# EAGLE schematic Proto (EAGLE 9.4.0)
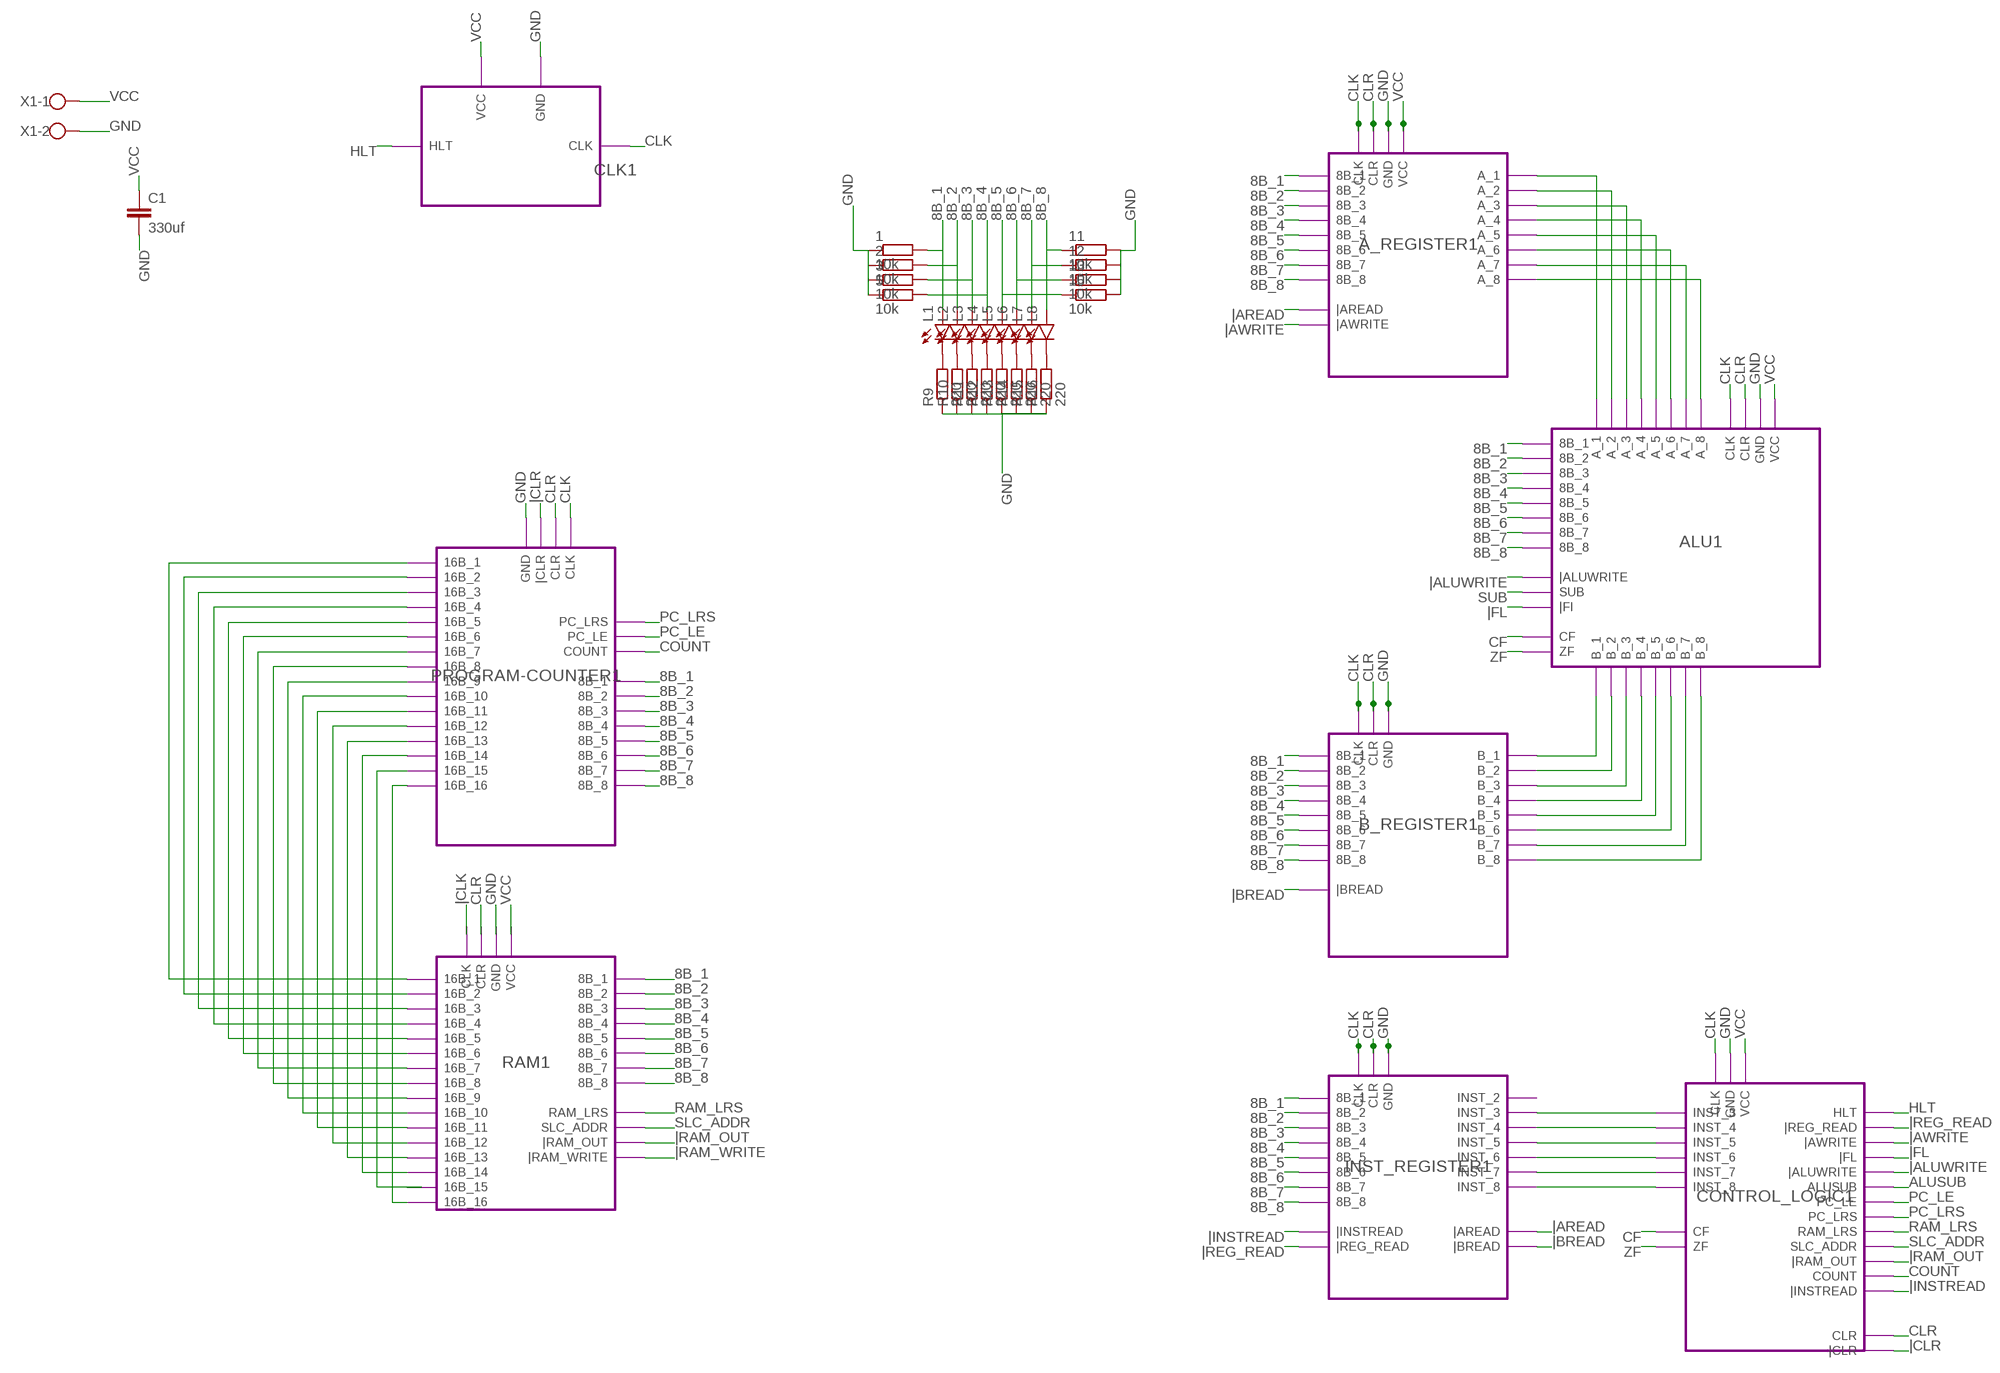
[diagram p0: schematic, sheet 1]

## Parts
1  10k  R-EU_0204/7  [0204/7]
2  10k  R-EU_0204/7  [0204/7]
3  10k  R-EU_0204/7  [0204/7]
5  10k  R-EU_0204/7  [0204/7]
11  10k  R-EU_0204/7  [0204/7]
12  10k  R-EU_0204/7  [0204/7]
13  10k  R-EU_0204/7  [0204/7]
15  10k  R-EU_0204/7  [0204/7]
C1  330uf  C-EU025-025X050  [C025-025X050]
L1  LED5MM  [LED5MM]
L2  LED5MM  [LED5MM]
L3  LED5MM  [LED5MM]
L4  LED5MM  [LED5MM]
L5  LED5MM  [LED5MM]
L6  LED5MM  [LED5MM]
L7  LED5MM  [LED5MM]
L8  LED5MM  [LED5MM]
R9  220  R-EU_0204/7  [0204/7]
R10  220  R-EU_0204/7  [0204/7]
R11  220  R-EU_0204/7  [0204/7]
R12  220  R-EU_0204/7  [0204/7]
R13  220  R-EU_0204/7  [0204/7]
R14  220  R-EU_0204/7  [0204/7]
R15  220  R-EU_0204/7  [0204/7]
R16  220  R-EU_0204/7  [0204/7]
X1  W237-102  [W237-102]

## Module instances
ALU1 = ALU
A_REGISTER1 = A_REGISTER
B_REGISTER1 = B_REGISTER
CLK1 = CLK
CONTROL_LOGIC1 = CONTROL_LOGIC
INST_REGISTER1 = INST_REGISTER
RAM1 = RAM
PROGRAM-COUNTER1 = PROGRAM-COUNTER

## Nets
8B_1: 1.2 L1.A ; port PROGRAM-COUNTER1.8B_1 RAM1.8B_1 A_REGISTER1.8B_1 ALU1.8B_1 B_REGISTER1.8B_1 INST_REGISTER1.8B_1
8B_2: 2.2 L2.A ; port PROGRAM-COUNTER1.8B_2 RAM1.8B_2 A_REGISTER1.8B_2 ALU1.8B_2 B_REGISTER1.8B_2 INST_REGISTER1.8B_2
8B_3: 3.2 L3.A ; port PROGRAM-COUNTER1.8B_3 RAM1.8B_3 A_REGISTER1.8B_3 ALU1.8B_3 B_REGISTER1.8B_3 INST_REGISTER1.8B_3
8B_4: 5.2 L4.A ; port PROGRAM-COUNTER1.8B_4 RAM1.8B_4 A_REGISTER1.8B_4 ALU1.8B_4 B_REGISTER1.8B_4 INST_REGISTER1.8B_4
8B_5: 15.1 L5.A ; port PROGRAM-COUNTER1.8B_5 RAM1.8B_5 A_REGISTER1.8B_5 ALU1.8B_5 B_REGISTER1.8B_5 INST_REGISTER1.8B_5
8B_6: 13.1 L6.A ; port PROGRAM-COUNTER1.8B_6 RAM1.8B_6 A_REGISTER1.8B_6 ALU1.8B_6 B_REGISTER1.8B_6 INST_REGISTER1.8B_6
8B_7: 12.1 L7.A ; port PROGRAM-COUNTER1.8B_7 RAM1.8B_7 A_REGISTER1.8B_7 ALU1.8B_7 B_REGISTER1.8B_7 INST_REGISTER1.8B_7
8B_8: 11.1 L8.A ; port PROGRAM-COUNTER1.8B_8 RAM1.8B_8 A_REGISTER1.8B_8 ALU1.8B_8 B_REGISTER1.8B_8 INST_REGISTER1.8B_8
ALUSUB: port CONTROL_LOGIC1.ALUSUB
CF: port ALU1.CF CONTROL_LOGIC1.CF
CLK: port CLK1.CLK PROGRAM-COUNTER1.CLK A_REGISTER1.CLK ALU1.CLK B_REGISTER1.CLK INST_REGISTER1.CLK CONTROL_LOGIC1.CLK
CLR: port PROGRAM-COUNTER1.CLR A_REGISTER1.CLR ALU1.CLR B_REGISTER1.CLR INST_REGISTER1.CLR CONTROL_LOGIC1.CLR
COUNT: port PROGRAM-COUNTER1.COUNT CONTROL_LOGIC1.COUNT
GND: 1.1 2.1 3.1 5.1 11.2 12.2 13.2 15.2 C1.2 R9.1 R10.1 R11.1 R12.1 R13.1 R14.1 R15.1 R16.1 X1.2 ; port CLK1.GND PROGRAM-COUNTER1.GND A_REGISTER1.GND ALU1.GND B_REGISTER1.GND INST_REGISTER1.GND CONTROL_LOGIC1.GND
HLT: port CLK1.HLT CONTROL_LOGIC1.HLT
N$1: port PROGRAM-COUNTER1.16B_16 RAM1.16B_16
N$2: port PROGRAM-COUNTER1.16B_15
N$3: port PROGRAM-COUNTER1.16B_14 RAM1.16B_14
N$4: port RAM1.16B_13 PROGRAM-COUNTER1.16B_13
N$5: port PROGRAM-COUNTER1.16B_12 RAM1.16B_12
N$6: port RAM1.16B_11 PROGRAM-COUNTER1.16B_11
N$7: port PROGRAM-COUNTER1.16B_10 RAM1.16B_10
N$8: port RAM1.16B_9 PROGRAM-COUNTER1.16B_9
N$9: port PROGRAM-COUNTER1.16B_8 RAM1.16B_8
N$10: port RAM1.16B_7 PROGRAM-COUNTER1.16B_7
N$11: port PROGRAM-COUNTER1.16B_6 RAM1.16B_6
N$12: port RAM1.16B_5 PROGRAM-COUNTER1.16B_5
N$13: port PROGRAM-COUNTER1.16B_4 RAM1.16B_4
N$14: port RAM1.16B_3 PROGRAM-COUNTER1.16B_3
N$15: port PROGRAM-COUNTER1.16B_2 RAM1.16B_2
N$16: port RAM1.16B_1 PROGRAM-COUNTER1.16B_1
N$17: port A_REGISTER1.A_1 ALU1.A_1
N$18: port A_REGISTER1.A_2 ALU1.A_2
N$19: port A_REGISTER1.A_3 ALU1.A_3
N$20: port ALU1.A_4 A_REGISTER1.A_4 A_REGISTER1.A_5 ALU1.A_5
N$21: port ALU1.A_6 A_REGISTER1.A_6
N$22: port A_REGISTER1.A_7 ALU1.A_7
N$23: port ALU1.A_8 A_REGISTER1.A_8
N$24: port B_REGISTER1.B_1 ALU1.B_1
N$25: port ALU1.B_2 B_REGISTER1.B_2
N$26: port B_REGISTER1.B_3 ALU1.B_3
N$27: port ALU1.B_4 B_REGISTER1.B_4
N$28: port B_REGISTER1.B_5 ALU1.B_5
N$29: port ALU1.B_6 B_REGISTER1.B_6
N$30: port B_REGISTER1.B_7 ALU1.B_7
N$31: port ALU1.B_8 B_REGISTER1.B_8
N$32: port INST_REGISTER1.INST_3 CONTROL_LOGIC1.INST_3
N$33: port CONTROL_LOGIC1.INST_4 INST_REGISTER1.INST_4
N$34: port INST_REGISTER1.INST_5 CONTROL_LOGIC1.INST_5
N$35: port CONTROL_LOGIC1.INST_6 INST_REGISTER1.INST_6
N$36: port INST_REGISTER1.INST_7 CONTROL_LOGIC1.INST_7
N$37: port CONTROL_LOGIC1.INST_8 INST_REGISTER1.INST_8
N$38: L1.K(C) R9.2
N$39: L2.K(C) R10.2
N$40: L3.K(C) R11.2
N$41: L4.K(C) R12.2
N$42: L5.K(C) R13.2
N$43: L6.K(C) R14.2
N$44: L7.K(C) R15.2
N$45: L8.K(C) R16.2
PC_LE: port PROGRAM-COUNTER1.PC_LE CONTROL_LOGIC1.PC_LE
PC_LRS: port PROGRAM-COUNTER1.PC_LRS CONTROL_LOGIC1.PC_LRS
RAM_LRS: port RAM1.RAM_LRS CONTROL_LOGIC1.RAM_LRS
SLC_ADDR: port RAM1.SLC_ADDR CONTROL_LOGIC1.SLC_ADDR
SUB: port ALU1.SUB
VCC: C1.1 X1.1 ; port CLK1.VCC A_REGISTER1.VCC ALU1.VCC CONTROL_LOGIC1.VCC
ZF: port ALU1.ZF CONTROL_LOGIC1.ZF
|ALUWRITE: port ALU1.|ALUWRITE CONTROL_LOGIC1.|ALUWRITE
|AREAD: port A_REGISTER1.|AREAD INST_REGISTER1.|AREAD
|AWRITE: port A_REGISTER1.|AWRITE CONTROL_LOGIC1.|AWRITE
|BREAD: port B_REGISTER1.|BREAD INST_REGISTER1.|BREAD
|CLR: port PROGRAM-COUNTER1.|CLR CONTROL_LOGIC1.|CLR
|FL: port ALU1.|FI CONTROL_LOGIC1.|FL
|INSTREAD: port CONTROL_LOGIC1.|INSTREAD INST_REGISTER1.|INSTREAD
|RAM_OUT: port RAM1.|RAM_OUT CONTROL_LOGIC1.|RAM_OUT
|RAM_WRITE: port RAM1.|RAM_WRITE
|REG_READ: port CONTROL_LOGIC1.|REG_READ INST_REGISTER1.|REG_READ

## Library data of the parts
1-3 5 11-13 15 R9-R16 = rcl:R-EU_: RESISTOR, European symbol; SPICEPREFIX: R
C1 = rcl:C-EU: CAPACITOR, European symbol; SPICEPREFIX: C
L1-L8 = led:LED: LED OSRAM: - CHIPLED LG R971, LG N971, LY N971, LG Q971, LY Q971, LO R971, LY R971 LH N974, LH R974 LS Q976, LO Q976, LY Q976 LO Q996 - Hyper CHIPLED LW Q18S LB Q993, LB Q99A, LB R99A - SideLED LS A670, LO A670, LY A670, LG A670, LP A670 LB A673, LV A673, LT A673, LW A673 LH A674 LY A675 LS A676, LA A676, LO A676, LY A676, LW A676 LS A679, LY A679, LG A679 - Hyper Micro SIDELED® LS Y876, LA Y876, LO Y876, LY Y876 LT Y87S - SmartLED LW L88C, LW L88S LB L89C, LB L89S, LG L890 LS L89K, LO L89K, LY L89K LS L896, LA L896, LO L896, LY L896 - TOPLED LS T670, LO T670, LY T670, LG T670, LP T670 LSG T670, LSP T670, LSY T670, LOP T670, LYG T670 LG T671, LOG T671, LSG T671 LB T673, LV T673, LT T673, LW T673 LH T674 LS T676, LA T676, LO T676, LY T676, LB T676, LH T676, LSB T676, LW T676 LB T67C, LV T67C, LT T67C, LS T67K, LO T67K, LY T67K, LW E67C LS E67B, LA E67B, LO E67B, LY E67B, LB E67C, LV E67C, LT E67C LW T67C LS T679, LY T679, LG T679 LS T770, LO T770, LY T770, LG T770, LP T770 LB T773, LV T773, LT T773, LW T773 LH T774 LS E675, LA E675, LY E675, LS T675 LS T776, LA T776, LO T776, LY T776, LB T776 LHGB T686 LT T68C, LB T68C - Hyper Mini TOPLED® LB M676 - Mini TOPLED Santana® LG M470 LS M47K, LO M47K, LY M47K Source: http://www.osram.convergy.de LUXEON: - LUMILED® LXK2-PW12-R00, LXK2-PW12-S00, LXK2-PW14-U00, LXK2-PW14-V00 LXK2-PM12-R00, LXK2-PM12-S00, LXK2-PM14-U00 LXK2-PE12-Q00, LXK2-PE12-R00, LXK2-PE12-S00, LXK2-PE14-T00, LXK2-PE14-U00 LXK2-PB12-K00, LXK2-PB12-L00, LXK2-PB12-M00, LXK2-PB14-N00, LXK2-PB14-P00, LXK2-PB14-Q00 LXK2-PR12-L00, LXK2-PR12-M00, LXK2-PR14-Q00, LXK2-PR14-R00 LXK2-PD12-Q00, LXK2-PD12-R00, LXK2-PD12-S00 LXK2-PH12-R00, LXK2-PH12-S00 LXK2-PL12-P00, LXK2-PL12-Q00, LXK2-PL12-R00 Source: www.luxeon.com KINGBRIGHT: KA-3528ASYC Source: www.kingbright.com
X1 = con-wago-500:W237-102: WAGO SCREW CLAMP; MPN: 237-102; OC_FARNELL: unknown; OC_NEWARK: 70K9898

## Module CLK
Ports: CLK(io) VCC(io) GND(io) HLT(io)
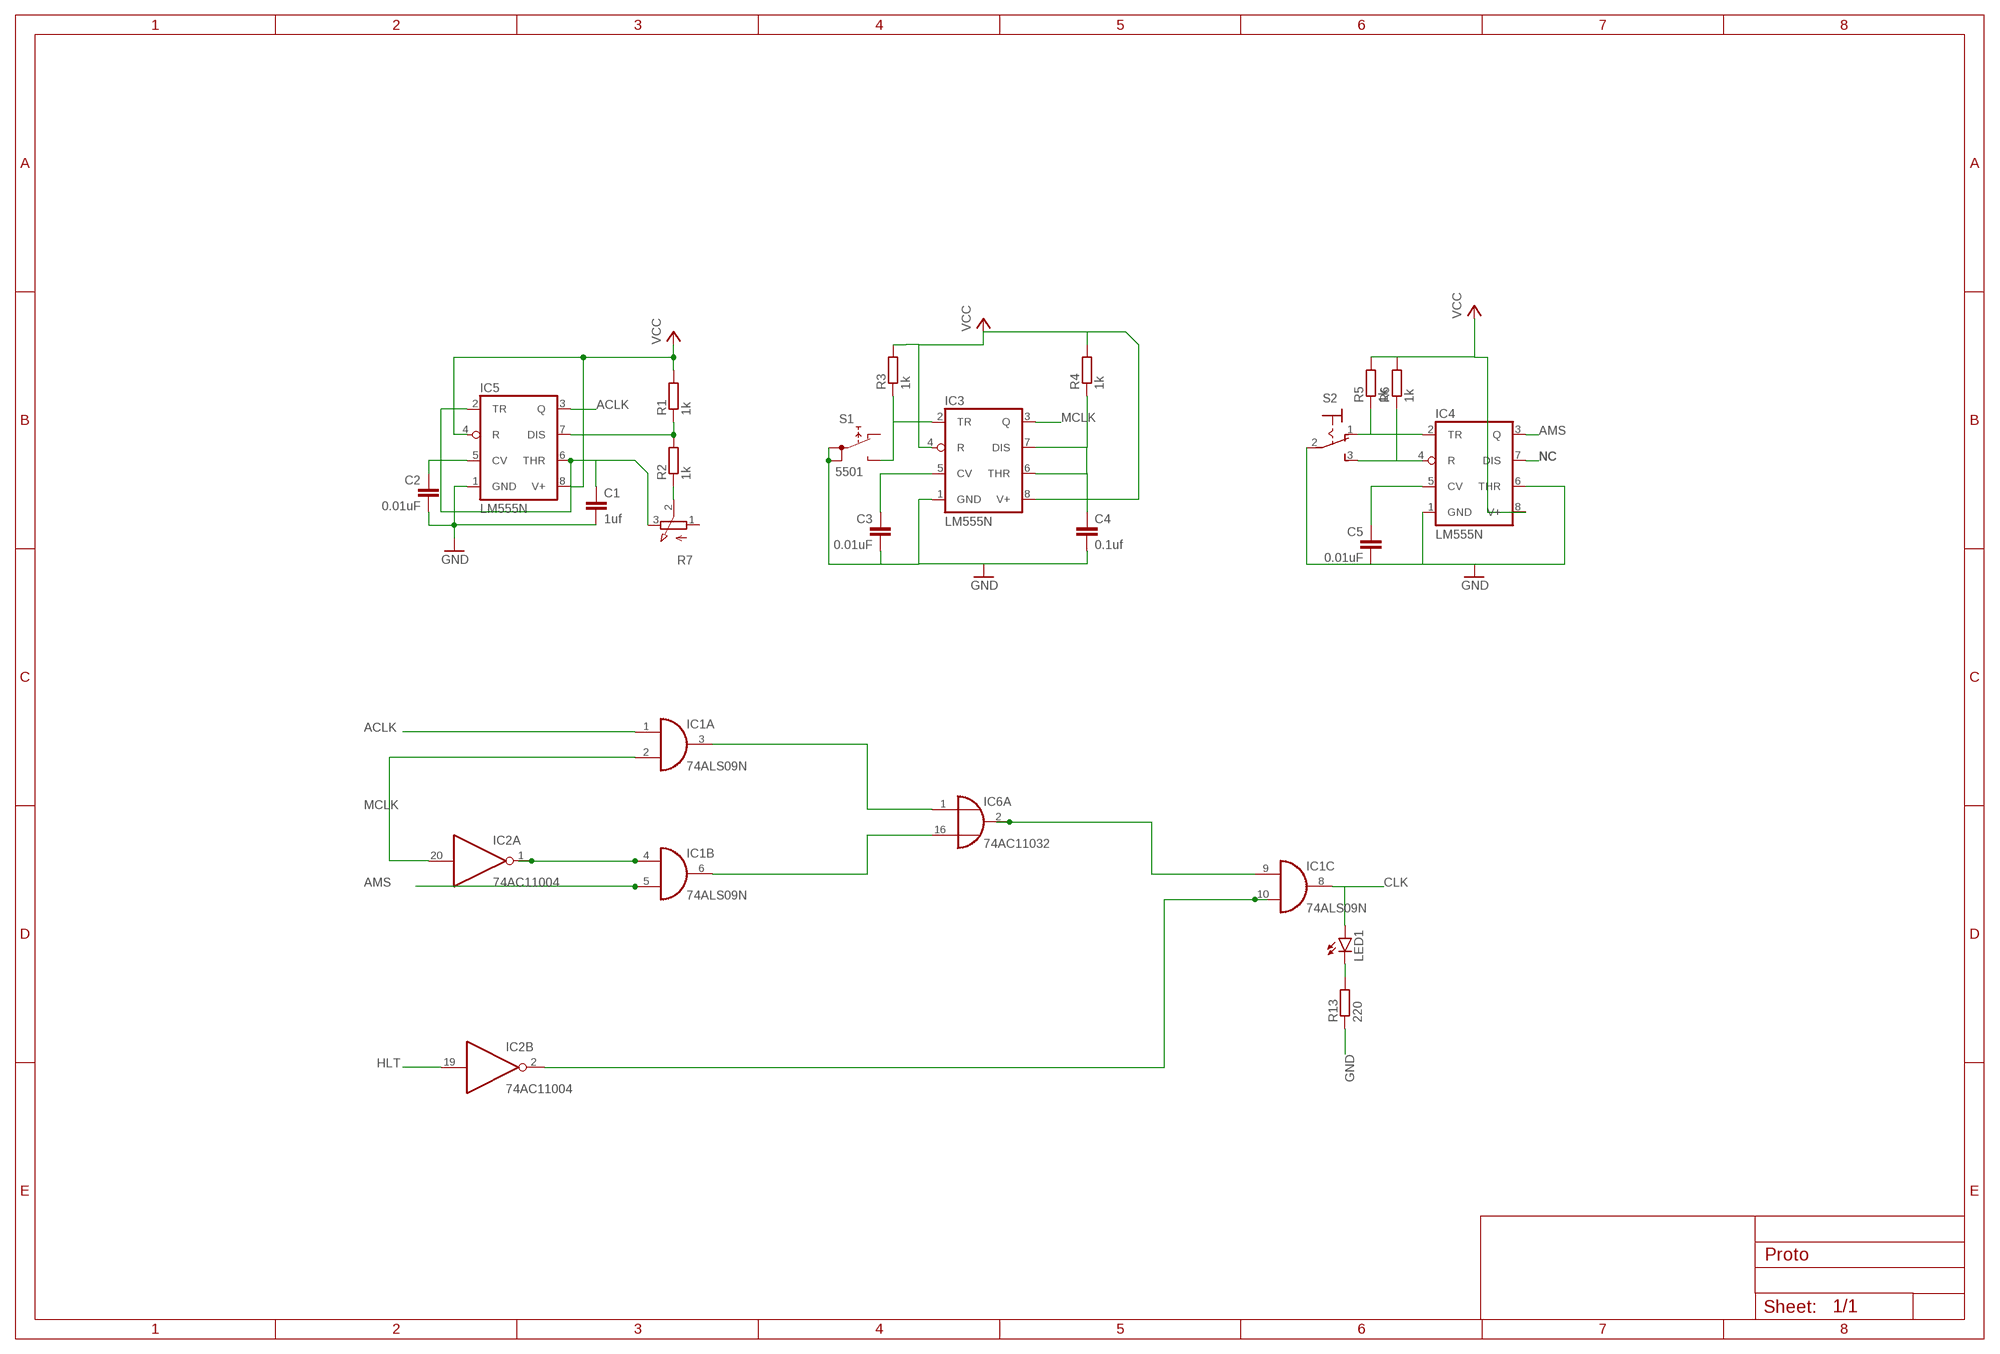
[diagram p1: schematic, module CLK, sheet 1]

### Parts
C1  1uf  C-EU025-024X044  [C025-024X044]
C2  0.01uF  C-EU025-025X050  [C025-025X050]
C3  0.01uF  C-EU025-024X044  [C025-024X044]
C4  0.1uf  C-EU025-024X044  [C025-024X044]
C5  0.01uF  C-EU025-024X044  [C025-024X044]
IC1  74ALS09N  [DIL14]
IC2  74AC11004  [DIL20]
IC3  LM555N  [DIL08]
IC4  LM555N  [DIL08]
IC5  LM555N  [DIL08]
IC6  74AC11032  [DIL16]
LED1  LED5MM  [LED5MM]
R1  1k  R-EU_0204/7  [0204/7]
R2  1k  R-EU_0204/7  [0204/7]
R3  1k  R-EU_0204/7  [0204/7]
R4  1k  R-EU_0204/7  [0204/7]
R5  1k  R-EU_0204/7  [0204/7]
R6  1k  R-EU_0204/7  [0204/7]
R7  3RP/1610N  [3RP/1610N]
R13  220  R-EU_0204/7  [0204/7]
S1  5501  [5501]
S2  320-916  [320-916]

### Nets
ACLK: IC1.1(A:I0) IC5.3(Q)
AMS: IC1.5(B:I1) IC4.3(Q)
CLK: IC1.8(C:O) LED1.A
GND: C1.2 C2.2 C3.2 C4.2 C5.2 IC3.1(GND) IC4.1(GND) IC4.6(THR) IC5.1(GND) R13.1 S1.1A S1.1B S2.2(P)
HLT: IC2.19(B:I)
MCLK: IC1.2(A:I1) IC2.20(A:I) IC3.3(Q)
N$1: IC4.2(TR) R5.1 S2.1(O)
N$2: IC3.2(TR) R3.1 S1.NO
N$3: IC4.4(R) R6.1 S2.3(S)
N$4: C3.1 IC3.5(CV)
N$5: C5.1 IC4.5(CV)
N$6: LED1.K(C) R13.2
N$7: C4.1 IC3.6(THR) IC3.7(DIS) R4.1
N$8: IC1.10(C:I1) IC2.2(B:O)
N$9: IC5.7(DIS) R1.1 R2.2
N$10: C2.1 IC5.5(CV)
N$11: R2.1 R7.2(S)
N$12: IC1.6(B:O) IC6.16(A:I2)
N$13: IC1.3(A:O) IC6.1(A:I1)
N$14: IC1.9(C:I0) IC6.2(A:O)
N$17: IC1.4(B:I0) IC2.1(A:O)
NC: IC4.7(DIS)
TRIGGER: C1.1 IC5.2(TR) IC5.6(THR) R7.3(E)
VCC: IC3.4(R) IC3.8(V+) IC4.8(V+) IC5.4(R) IC5.8(V+) R1.2 R3.2 R4.2 R5.2 R6.2
Unconnected: IC1.11(D:O) IC1.12(D:I0) IC1.13(D:I1) IC2.3(C:O) IC2.8(D:O) IC2.9(E:O) IC2.10(F:O) IC2.11(F:I) IC2.12(E:I) IC2.13(D:I) IC2.18(C:I) IC6.3(B:O) IC6.6(C:O) IC6.7(D:O) IC6.8(D:I2) IC6.9(D:I1) IC6.10(C:I2) IC6.11(C:I1) IC6.14(B:I2) IC6.15(B:I1) R7.1(A) S1.NC

### Power pins joined to a net without a drawn wire
GND: IC1.7(P:GND) IC2.4(P:GND) IC2.5(P:GND) IC2.6(P:GND) IC2.7(P:GND) IC6.4(P:GND) IC6.5(P:GND)
VCC: IC1.14(P:VCC) IC2.15(P:VCC) IC2.16(P:VCC) IC6.12(P:VCC) IC6.13(P:VCC)

### Library data of the parts
C1-C5 = rcl:C-EU: CAPACITOR, European symbol; SPICEPREFIX: C
IC1 = 74xx-eu:74*09: Quad 2-input AND gate, open collector
IC2 = 74ac-logic:74AC11004: Hex INVERTER
IC3-IC5 = linear:*555: TIMER
IC6 = 74ac-logic:74AC11032: Quadruple 2-input OR
LED1 = led:LED: LED OSRAM: - CHIPLED LG R971, LG N971, LY N971, LG Q971, LY Q971, LO R971, LY R971 LH N974, LH R974 LS Q976, LO Q976, LY Q976 LO Q996 - Hyper CHIPLED LW Q18S LB Q993, LB Q99A, LB R99A - SideLED LS A670, LO A670, LY A670, LG A670, LP A670 LB A673, LV A673, LT A673, LW A673 LH A674 LY A675 LS A676, LA A676, LO A676, LY A676, LW A676 LS A679, LY A679, LG A679 - Hyper Micro SIDELED® LS Y876, LA Y876, LO Y876, LY Y876 LT Y87S - SmartLED LW L88C, LW L88S LB L89C, LB L89S, LG L890 LS L89K, LO L89K, LY L89K LS L896, LA L896, LO L896, LY L896 - TOPLED LS T670, LO T670, LY T670, LG T670, LP T670 LSG T670, LSP T670, LSY T670, LOP T670, LYG T670 LG T671, LOG T671, LSG T671 LB T673, LV T673, LT T673, LW T673 LH T674 LS T676, LA T676, LO T676, LY T676, LB T676, LH T676, LSB T676, LW T676 LB T67C, LV T67C, LT T67C, LS T67K, LO T67K, LY T67K, LW E67C LS E67B, LA E67B, LO E67B, LY E67B, LB E67C, LV E67C, LT E67C LW T67C LS T679, LY T679, LG T679 LS T770, LO T770, LY T770, LG T770, LP T770 LB T773, LV T773, LT T773, LW T773 LH T774 LS E675, LA E675, LY E675, LS T675 LS T776, LA T776, LO T776, LY T776, LB T776 LHGB T686 LT T68C, LB T68C - Hyper Mini TOPLED® LB M676 - Mini TOPLED Santana® LG M470 LS M47K, LO M47K, LY M47K Source: http://www.osram.convergy.de LUXEON: - LUMILED® LXK2-PW12-R00, LXK2-PW12-S00, LXK2-PW14-U00, LXK2-PW14-V00 LXK2-PM12-R00, LXK2-PM12-S00, LXK2-PM14-U00 LXK2-PE12-Q00, LXK2-PE12-R00, LXK2-PE12-S00, LXK2-PE14-T00, LXK2-PE14-U00 LXK2-PB12-K00, LXK2-PB12-L00, LXK2-PB12-M00, LXK2-PB14-N00, LXK2-PB14-P00, LXK2-PB14-Q00 LXK2-PR12-L00, LXK2-PR12-M00, LXK2-PR14-Q00, LXK2-PR14-R00 LXK2-PD12-Q00, LXK2-PD12-R00, LXK2-PD12-S00 LXK2-PH12-R00, LXK2-PH12-S00 LXK2-PL12-P00, LXK2-PL12-Q00, LXK2-PL12-R00 Source: www.luxeon.com KINGBRIGHT: KA-3528ASYC Source: www.kingbright.com
R1-R6 R13 = rcl:R-EU_: RESISTOR, European symbol; SPICEPREFIX: R
R7 = pot:3RP/1610N: 16mm Potentiometer one level Source: http://www.alphapotentiometers.net/html/16mm_pot_2.html
S1 = switch:55?: PUSHBUTTON SERIES 5500 SWITCHES Source: www.e-switch.com .. 5500.pdf
S2 = switch:320-916: TOGGLE SWITCH distributor RS Components

## Module PROGRAM-COUNTER
Ports: 16B_1(io) 16B_2(io) 16B_3(io) 16B_4(io) 16B_5(io) 16B_6(io) 16B_7(io) 16B_8(io) 16B_9(io) 16B_10(io) 16B_11(io) 16B_12(io) 16B_13(io) 16B_14(io) 16B_15(io) 16B_16(io) 8B_8(io) 8B_7(io) 8B_6(io) 8B_5(io) 8B_4(io) 8B_3(io) 8B_2(io) 8B_1(io) CLK(io) CLR(io) COUNT(io) PC_LE(io) PC_LRS(io) |CLR(io) GND(io)
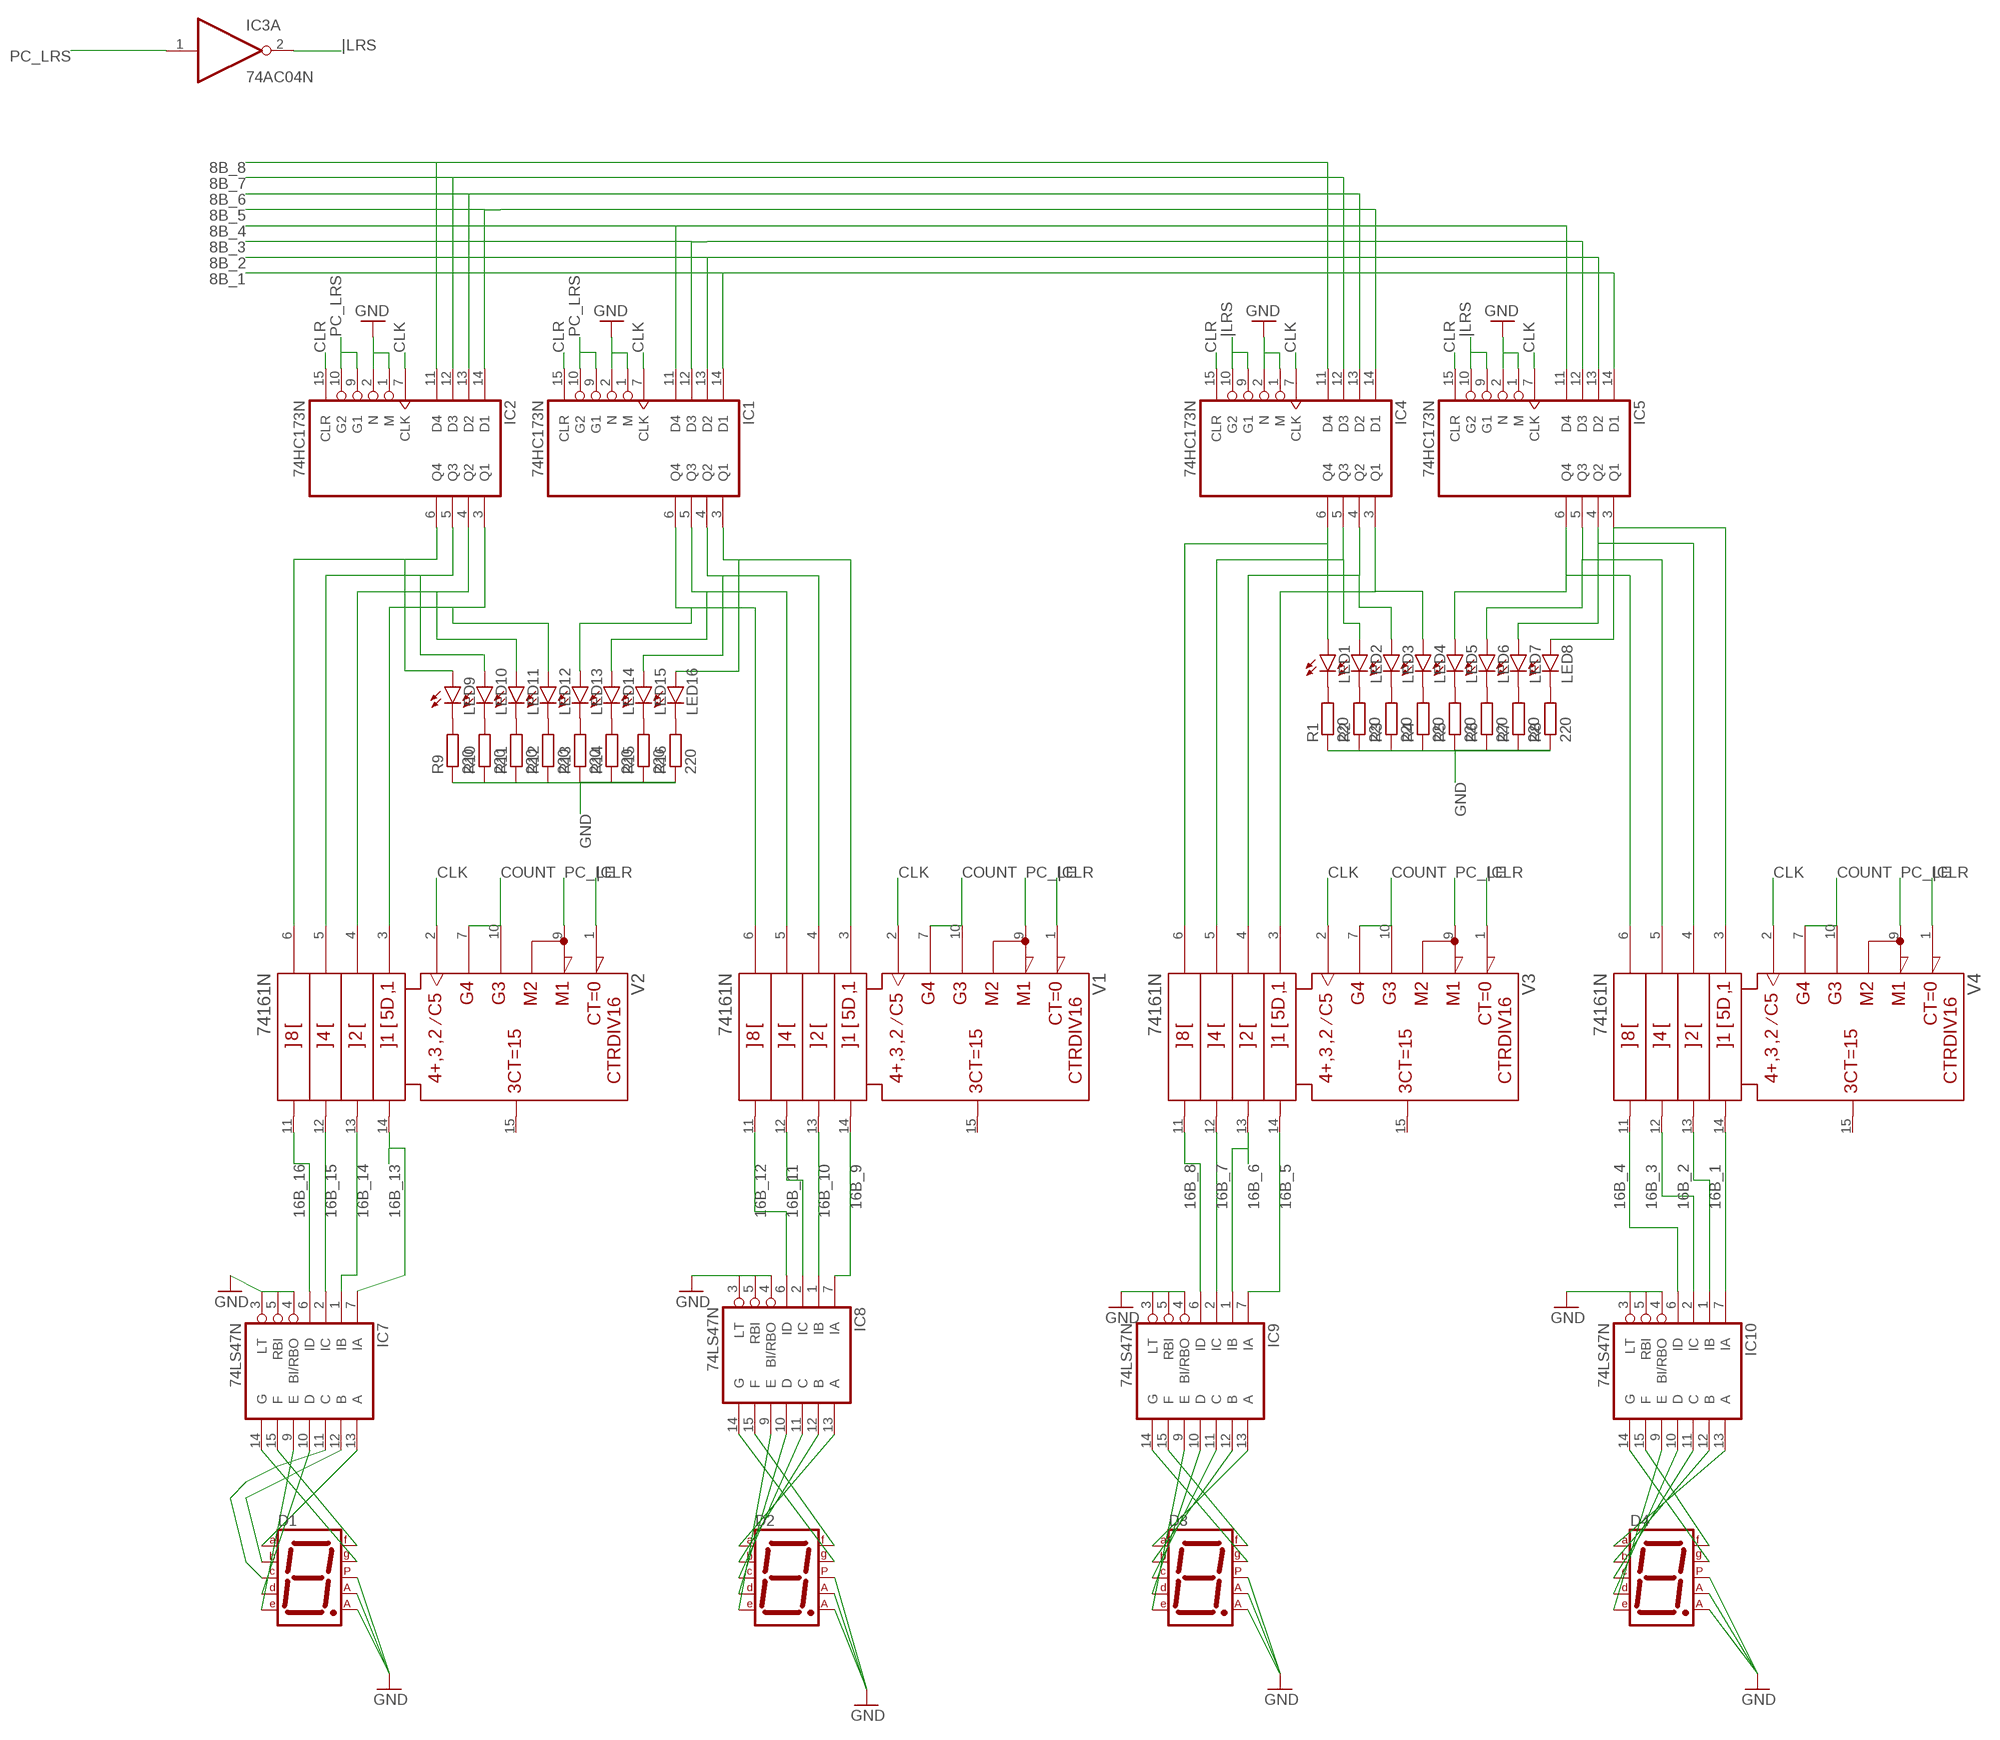
[diagram p2: schematic, module PROGRAM-COUNTER, sheet 1]

### Parts
D1  7SEG-CA  [7SEG-13]
D2  7SEG-CA  [7SEG-13]
D3  7SEG-CA  [7SEG-13]
D4  7SEG-CA  [7SEG-13]
IC1  74HC173N  [DIL16]
IC2  74HC173N  [DIL16]
IC3  74AC04N  [DIL14]
IC4  74HC173N  [DIL16]
IC5  74HC173N  [DIL16]
IC7  74LS47N  [DIL16]
IC8  74LS47N  [DIL16]
IC9  74LS47N  [DIL16]
IC10  74LS47N  [DIL16]
LED1  LED5MM  [LED5MM]
LED2  LED5MM  [LED5MM]
LED3  LED5MM  [LED5MM]
LED4  LED5MM  [LED5MM]
LED5  LED5MM  [LED5MM]
LED6  LED5MM  [LED5MM]
LED7  LED5MM  [LED5MM]
LED8  LED5MM  [LED5MM]
LED9  LED5MM  [LED5MM]
LED10  LED5MM  [LED5MM]
LED11  LED5MM  [LED5MM]
LED12  LED5MM  [LED5MM]
LED13  LED5MM  [LED5MM]
LED14  LED5MM  [LED5MM]
LED15  LED5MM  [LED5MM]
LED16  LED5MM  [LED5MM]
R1  220  R-EU_0204/7  [0204/7]
R2  220  R-EU_0204/7  [0204/7]
R3  220  R-EU_0204/7  [0204/7]
R4  220  R-EU_0204/7  [0204/7]
R5  220  R-EU_0204/7  [0204/7]
R6  220  R-EU_0204/7  [0204/7]
R7  220  R-EU_0204/7  [0204/7]
R8  220  R-EU_0204/7  [0204/7]
R9  220  R-EU_0204/7  [0204/7]
R10  220  R-EU_0204/7  [0204/7]
R11  220  R-EU_0204/7  [0204/7]
R12  220  R-EU_0204/7  [0204/7]
R13  220  R-EU_0204/7  [0204/7]
R14  220  R-EU_0204/7  [0204/7]
R15  220  R-EU_0204/7  [0204/7]
R16  220  R-EU_0204/7  [0204/7]
V1  74161N  [DIL16]
V2  74161N  [DIL16]
V3  74161N  [DIL16]
V4  74161N  [DIL16]

### Nets
8B_1: IC1.14(D1) IC5.14(D1)
8B_2: IC1.13(D2) IC5.13(D2)
8B_3: IC1.12(D3) IC5.12(D3)
8B_4: IC1.11(D4) IC5.11(D4)
8B_5: IC2.14(D1) IC4.14(D1)
8B_6: IC2.13(D2) IC4.13(D2)
8B_7: IC2.12(D3) IC4.12(D3)
8B_8: IC2.11(D4) IC4.11(D4)
16B_1: IC10.7(IA) V4.14(QA)
16B_2: IC10.1(IB) V4.13(QB)
16B_3: IC10.2(IC) V4.12(QC)
16B_4: IC10.6(ID) V4.11(QD)
16B_5: IC9.7(IA) V3.14(QA)
16B_6: IC9.1(IB) V3.13(QB)
16B_7: IC9.2(IC) V3.12(QC)
16B_8: IC9.6(ID) V3.11(QD)
16B_9: IC8.7(IA) V1.14(QA)
16B_10: IC8.1(IB) V1.13(QB)
16B_11: IC8.2(IC) V1.12(QC)
16B_12: IC8.6(ID) V1.11(QD)
16B_13: IC7.7(IA) V2.14(QA)
16B_14: IC7.1(IB) V2.13(QB)
16B_15: IC7.2(IC) V2.12(QC)
16B_16: IC7.6(ID) V2.11(QD)
CLK: IC1.7(CLK) IC2.7(CLK) IC4.7(CLK) IC5.7(CLK) V1.2(CLK) V2.2(CLK) V3.2(CLK) V4.2(CLK)
CLR: IC1.15(CLR) IC2.15(CLR) IC4.15(CLR) IC5.15(CLR)
COUNT: V1.7(ENP) V1.10(ENT) V2.7(ENP) V2.10(ENT) V3.7(ENP) V3.10(ENT) V4.7(ENP) V4.10(ENT)
GND: D1.3(CA1) D1.5(DP) D1.8(CA2) D2.3(CA1) D2.5(DP) D2.8(CA2) D3.3(CA1) D3.5(DP) D3.8(CA2) D4.3(CA1) D4.5(DP) D4.8(CA2) IC1.1(M) IC1.2(N) IC2.1(M) IC2.2(N) IC4.1(M) IC4.2(N) IC5.1(M) IC5.2(N) IC7.3(LT) IC7.4(BI/RBO) IC7.5(RBI) IC8.3(LT) IC8.4(BI/RBO) IC8.5(RBI) IC9.3(LT) IC9.4(BI/RBO) IC9.5(RBI) IC10.3(LT) IC10.4(BI/RBO) IC10.5(RBI) R1.1 R2.1 R3.1 R4.1 R5.1 R6.1 R7.1 R8.1 R9.1 R10.1 R11.1 R12.1 R13.1 R14.1 R15.1 R16.1
N$1: IC1.6(Q4) LED13.A V1.6(D)
N$2: IC2.6(Q4) LED9.A V2.6(D)
N$3: IC2.5(Q3) LED10.A V2.5(C)
N$4: IC2.4(Q2) LED11.A V2.4(B)
N$5: IC2.3(Q1) LED12.A V2.3(A)
N$6: IC1.5(Q3) LED14.A V1.5(C)
N$7: IC1.4(Q2) LED15.A V1.4(B)
N$8: IC1.3(Q1) LED16.A V1.3(A)
N$9: D1.7(A) IC7.13(A)
N$10: D1.6(B) IC7.12(B)
N$11: D1.4(C) IC7.11(C)
N$12: D1.2(D) IC7.10(D)
N$13: D1.1(E) IC7.9(E)
N$14: D1.9(F) IC7.15(F)
N$15: D1.10(G) IC7.14(G)
N$16: D2.7(A) IC8.13(A)
N$17: IC4.6(Q4) LED1.A V3.6(D)
N$18: IC4.5(Q3) LED2.A V3.5(C)
N$19: IC4.4(Q2) LED3.A V3.4(B)
N$20: IC4.3(Q1) LED4.A V3.3(A)
N$21: D2.6(B) IC8.12(B)
N$22: D2.4(C) IC8.11(C)
N$23: D2.2(D) IC8.10(D)
N$24: D2.1(E) IC8.9(E)
N$25: IC5.6(Q4) LED5.A V4.6(D)
N$26: IC5.5(Q3) LED6.A V4.5(C)
N$27: IC5.4(Q2) LED7.A V4.4(B)
N$28: IC5.3(Q1) LED8.A V4.3(A)
N$29: D2.9(F) IC8.15(F)
N$30: D2.10(G) IC8.14(G)
N$31: D3.7(A) IC9.13(A)
N$32: D3.6(B) IC9.12(B)
N$33: D3.4(C) IC9.11(C)
N$34: D3.2(D) IC9.10(D)
N$35: D3.1(E) IC9.9(E)
N$36: D3.9(F) IC9.15(F)
N$37: D3.10(G) IC9.14(G)
N$38: D4.7(A) IC10.13(A)
N$39: D4.6(B) IC10.12(B)
N$40: D4.4(C) IC10.11(C)
N$41: D4.2(D) IC10.10(D)
N$42: D4.1(E) IC10.9(E)
N$43: D4.9(F) IC10.15(F)
N$44: D4.10(G) IC10.14(G)
N$45: LED9.K(C) R9.2
N$46: LED10.K(C) R10.2
N$47: LED11.K(C) R11.2
N$48: LED12.K(C) R12.2
N$49: LED13.K(C) R13.2
N$50: LED14.K(C) R14.2
N$51: LED15.K(C) R15.2
N$52: LED16.K(C) R16.2
N$53: LED1.K(C) R1.2
N$54: LED2.K(C) R2.2
N$55: LED3.K(C) R3.2
N$56: LED4.K(C) R4.2
N$57: LED5.K(C) R5.2
N$58: LED6.K(C) R6.2
N$59: LED7.K(C) R7.2
N$60: LED8.K(C) R8.2
PC_LE: V1.9(!LOAD) V2.9(!LOAD) V3.9(!LOAD) V4.9(!LOAD)
PC_LRS: IC1.9(G1) IC1.10(G2) IC2.9(G1) IC2.10(G2) IC3.1(A:I)
|CLR: V1.1(!CLR) V2.1(!CLR) V3.1(!CLR) V4.1(!CLR)
|LRS: IC3.2(A:O) IC4.9(G1) IC4.10(G2) IC5.9(G1) IC5.10(G2)
Unconnected: IC3.3(B:I) IC3.4(B:O) IC3.5(C:I) IC3.6(C:O) IC3.8(D:O) IC3.9(D:I) IC3.10(E:O) IC3.11(E:I) IC3.12(F:O) IC3.13(F:I) V1.15(RCO) V2.15(RCO) V3.15(RCO) V4.15(RCO)

### Power pins joined to a net without a drawn wire
+UB: V1.16(+UB) V2.16(+UB) V3.16(+UB) V4.16(+UB)
-UB: V1.8(-UB) V2.8(-UB) V3.8(-UB) V4.8(-UB)
GND: IC1.8(GND) IC2.8(GND) IC3.7(P:GND) IC4.8(GND) IC5.8(GND) IC7.8(GND) IC8.8(GND) IC9.8(GND) IC10.8(GND)
VCC: IC1.16(VCC) IC2.16(VCC) IC3.14(P:VCC) IC4.16(VCC) IC5.16(VCC) IC7.16(VCC) IC8.16(VCC) IC9.16(VCC) IC10.16(VCC)

### Library data of the parts
D1-D4 = special:7SEG-CA: 7-segment DISPLAY single anode, 13 mm
IC1 IC2 IC4 IC5 = 74xx-eu:74*173: 4-bit D type REGISTER, 3-state
IC3 = 74xx-eu:74*04: Hex INVERTER
IC7-IC10 = 74xx-eu:74*47: BCD to seven segment DECODER/DRIVER Source: http://www.ee.washington.edu/stores/DataSheets/74ls/74ls47.pdf
LED1-LED16 = led:LED: LED OSRAM: - CHIPLED LG R971, LG N971, LY N971, LG Q971, LY Q971, LO R971, LY R971 LH N974, LH R974 LS Q976, LO Q976, LY Q976 LO Q996 - Hyper CHIPLED LW Q18S LB Q993, LB Q99A, LB R99A - SideLED LS A670, LO A670, LY A670, LG A670, LP A670 LB A673, LV A673, LT A673, LW A673 LH A674 LY A675 LS A676, LA A676, LO A676, LY A676, LW A676 LS A679, LY A679, LG A679 - Hyper Micro SIDELED® LS Y876, LA Y876, LO Y876, LY Y876 LT Y87S - SmartLED LW L88C, LW L88S LB L89C, LB L89S, LG L890 LS L89K, LO L89K, LY L89K LS L896, LA L896, LO L896, LY L896 - TOPLED LS T670, LO T670, LY T670, LG T670, LP T670 LSG T670, LSP T670, LSY T670, LOP T670, LYG T670 LG T671, LOG T671, LSG T671 LB T673, LV T673, LT T673, LW T673 LH T674 LS T676, LA T676, LO T676, LY T676, LB T676, LH T676, LSB T676, LW T676 LB T67C, LV T67C, LT T67C, LS T67K, LO T67K, LY T67K, LW E67C LS E67B, LA E67B, LO E67B, LY E67B, LB E67C, LV E67C, LT E67C LW T67C LS T679, LY T679, LG T679 LS T770, LO T770, LY T770, LG T770, LP T770 LB T773, LV T773, LT T773, LW T773 LH T774 LS E675, LA E675, LY E675, LS T675 LS T776, LA T776, LO T776, LY T776, LB T776 LHGB T686 LT T68C, LB T68C - Hyper Mini TOPLED® LB M676 - Mini TOPLED Santana® LG M470 LS M47K, LO M47K, LY M47K Source: http://www.osram.convergy.de LUXEON: - LUMILED® LXK2-PW12-R00, LXK2-PW12-S00, LXK2-PW14-U00, LXK2-PW14-V00 LXK2-PM12-R00, LXK2-PM12-S00, LXK2-PM14-U00 LXK2-PE12-Q00, LXK2-PE12-R00, LXK2-PE12-S00, LXK2-PE14-T00, LXK2-PE14-U00 LXK2-PB12-K00, LXK2-PB12-L00, LXK2-PB12-M00, LXK2-PB14-N00, LXK2-PB14-P00, LXK2-PB14-Q00 LXK2-PR12-L00, LXK2-PR12-M00, LXK2-PR14-Q00, LXK2-PR14-R00 LXK2-PD12-Q00, LXK2-PD12-R00, LXK2-PD12-S00 LXK2-PH12-R00, LXK2-PH12-S00 LXK2-PL12-P00, LXK2-PL12-Q00, LXK2-PL12-R00 Source: www.luxeon.com KINGBRIGHT: KA-3528ASYC Source: www.kingbright.com
R1-R16 = rcl:R-EU_: RESISTOR, European symbol; SPICEPREFIX: R
V1-V4 = 74ttl-din:74*161: Synchrounus 4-bit COUNTER

## Module A_REGISTER
Ports: 8B_1(io) 8B_2(io) 8B_4(io) 8B_3(io) 8B_5(io) 8B_6(io) 8B_7(io) 8B_8(io) A_1(io) A_2(io) A_3(io) A_4(io) A_5(io) A_6(io) A_7(io) A_8(io) |AREAD(io) |AWRITE(io) CLK(io) CLR(io) GND(io) VCC(io)
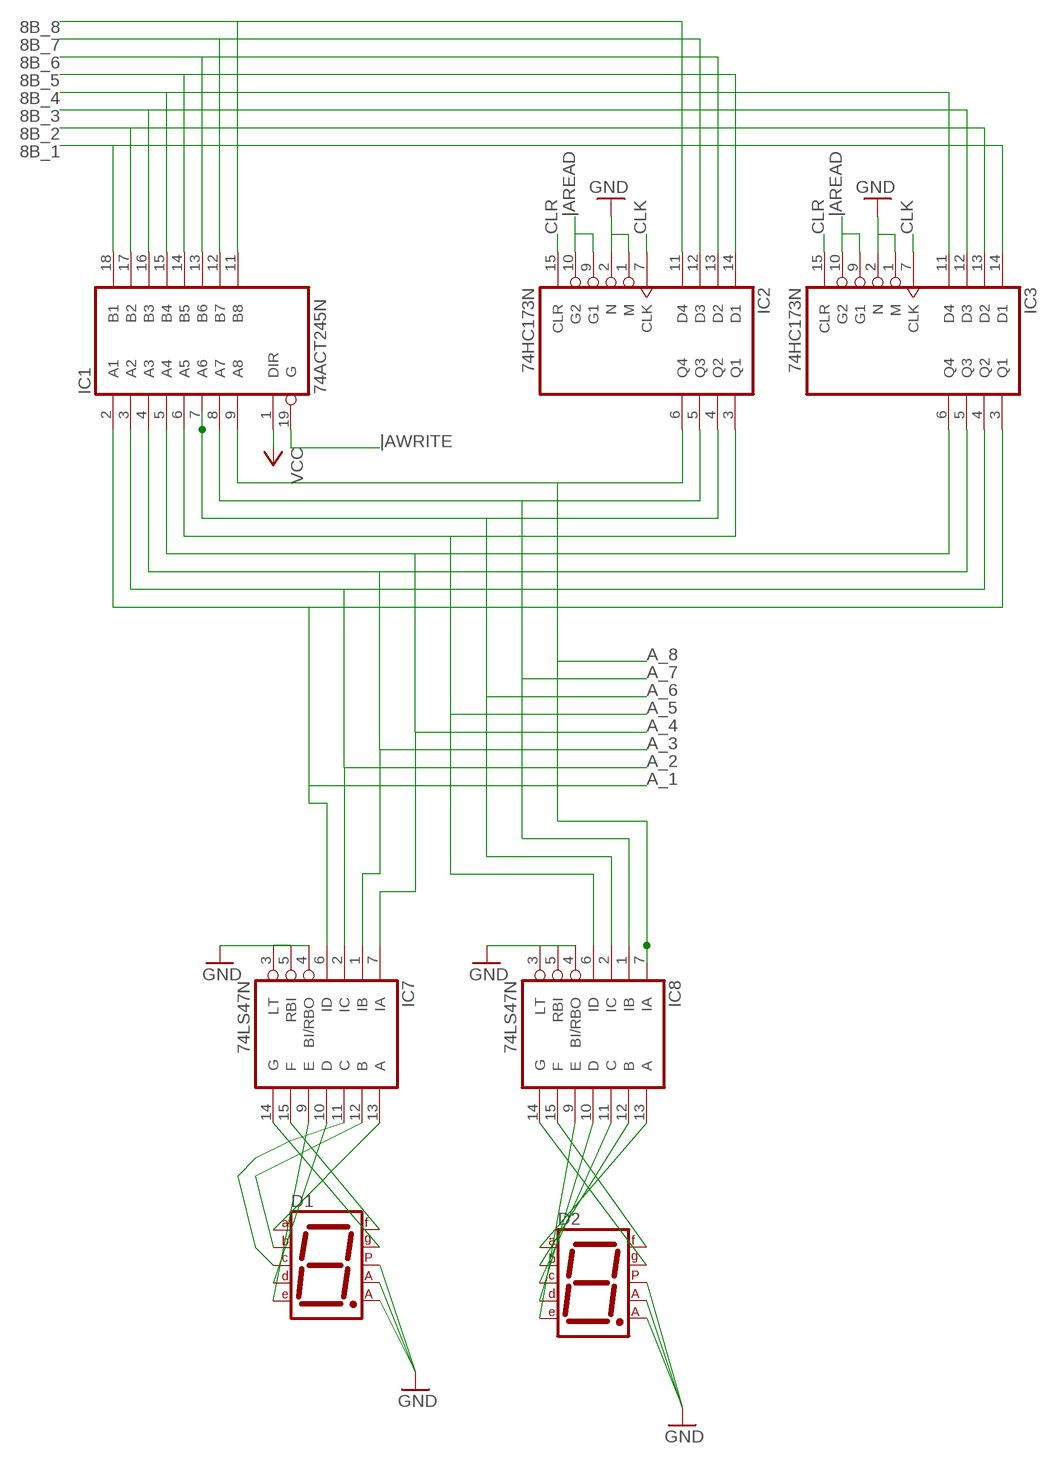
[diagram p3: schematic, module A_REGISTER, sheet 1]

### Parts
D1  7SEG-CA  [7SEG-13]
D2  7SEG-CA  [7SEG-13]
IC1  74ACT245N  [DIL20]
IC2  74HC173N  [DIL16]
IC3  74HC173N  [DIL16]
IC7  74LS47N  [DIL16]
IC8  74LS47N  [DIL16]

### Nets
8B_1: IC1.18(B1) IC3.14(D1)
8B_2: IC1.17(B2) IC3.13(D2)
8B_3: IC1.16(B3) IC3.12(D3)
8B_4: IC1.15(B4) IC3.11(D4)
8B_5: IC1.14(B5) IC2.14(D1)
8B_6: IC1.13(B6) IC2.13(D2)
8B_7: IC1.12(B7) IC2.12(D3)
8B_8: IC1.11(B8) IC2.11(D4)
A_1: IC1.2(A1) IC3.3(Q1) IC7.6(ID)
A_2: IC1.3(A2) IC3.4(Q2) IC7.2(IC)
A_3: IC1.4(A3) IC3.5(Q3) IC7.1(IB)
A_4: IC1.5(A4) IC3.6(Q4) IC7.7(IA)
A_5: IC1.6(A5) IC2.3(Q1) IC8.6(ID)
A_6: IC1.7(A6) IC2.4(Q2) IC8.2(IC)
A_7: IC1.8(A7) IC2.5(Q3) IC8.1(IB)
A_8: IC1.9(A8) IC2.6(Q4) IC8.7(IA)
CLK: IC2.7(CLK) IC3.7(CLK)
CLR: IC2.15(CLR) IC3.15(CLR)
GND: D1.3(CA1) D1.5(DP) D1.8(CA2) D2.3(CA1) D2.5(DP) D2.8(CA2) IC2.1(M) IC2.2(N) IC3.1(M) IC3.2(N) IC7.3(LT) IC7.4(BI/RBO) IC7.5(RBI) IC8.3(LT) IC8.4(BI/RBO) IC8.5(RBI)
N$9: D1.7(A) IC7.13(A)
N$10: D1.6(B) IC7.12(B)
N$11: D1.4(C) IC7.11(C)
N$12: D1.2(D) IC7.10(D)
N$13: D1.1(E) IC7.9(E)
N$14: D1.9(F) IC7.15(F)
N$15: D1.10(G) IC7.14(G)
N$16: D2.7(A) IC8.13(A)
N$21: D2.6(B) IC8.12(B)
N$22: D2.4(C) IC8.11(C)
N$23: D2.2(D) IC8.10(D)
N$24: D2.1(E) IC8.9(E)
N$29: D2.9(F) IC8.15(F)
N$30: D2.10(G) IC8.14(G)
VCC: IC1.1(DIR)
|AREAD: IC2.9(G1) IC2.10(G2) IC3.9(G1) IC3.10(G2)
|AWRITE: IC1.19(G)

### Power pins joined to a net without a drawn wire
GND: IC1.10(GND) IC2.8(GND) IC3.8(GND) IC7.8(GND) IC8.8(GND)
VCC: IC1.20(VCC) IC2.16(VCC) IC3.16(VCC) IC7.16(VCC) IC8.16(VCC)

### Library data of the parts
D1 D2 = special:7SEG-CA: 7-segment DISPLAY single anode, 13 mm
IC1 = 74xx-eu:74*245: Octal BUS TRANSCEIVER, 3-state
IC2 IC3 = 74xx-eu:74*173: 4-bit D type REGISTER, 3-state
IC7 IC8 = 74xx-eu:74*47: BCD to seven segment DECODER/DRIVER Source: http://www.ee.washington.edu/stores/DataSheets/74ls/74ls47.pdf

## Module B_REGISTER
Ports: CLK(io) CLR(io) GND(io) 8B_1(io) 8B_2(io) 8B_3(io) 8B_4(io) 8B_5(io) 8B_6(io) 8B_7(io) 8B_8(io) |BREAD(io) B_1(io) B_3(io) B_2(io) B_4(io) B_5(io) B_6(io) B_7(io) B_8(io)
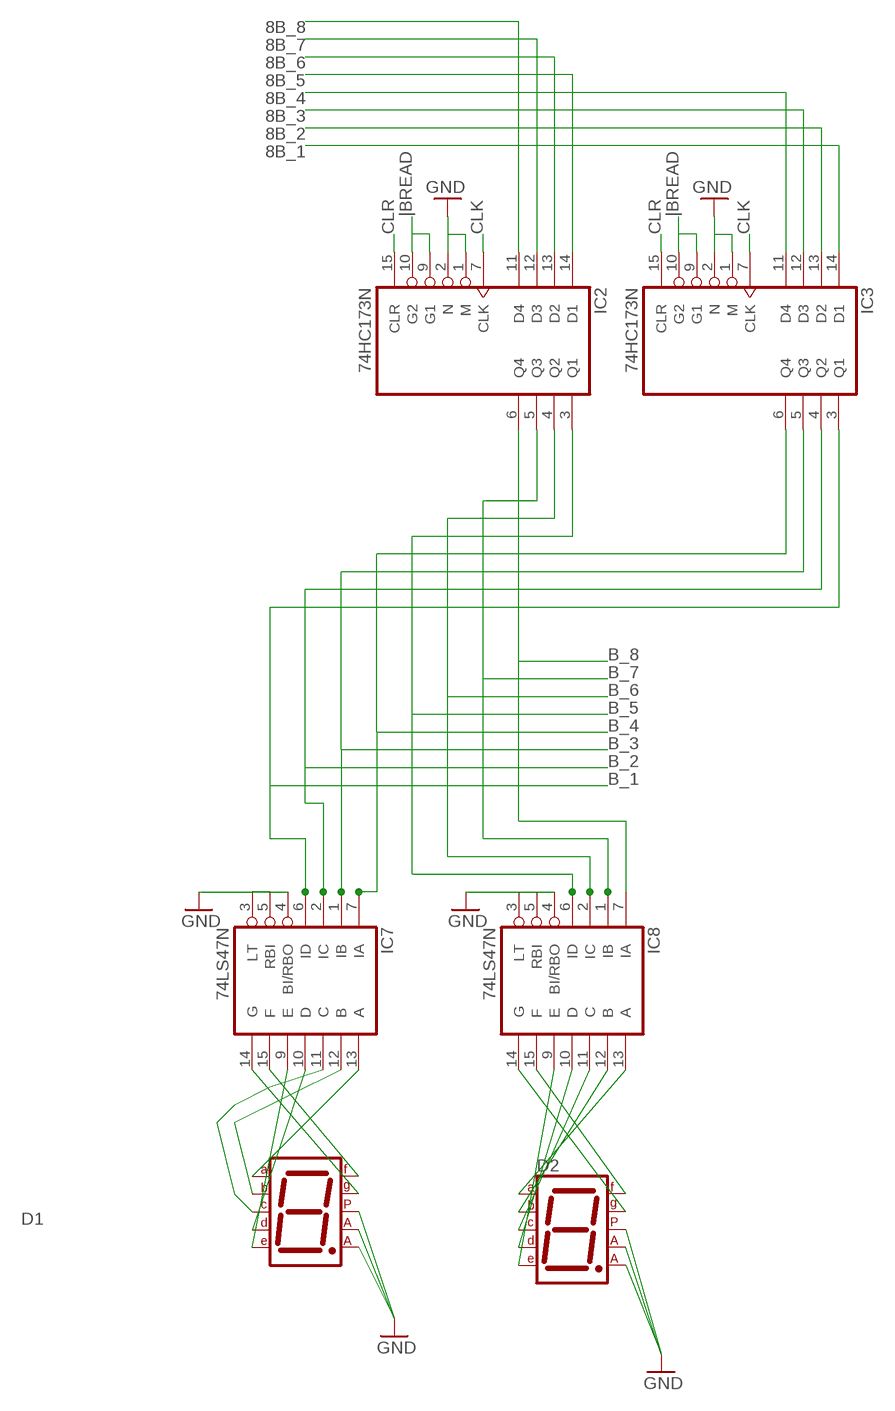
[diagram p4: schematic, module B_REGISTER, sheet 1]

### Parts
D1  7SEG-CA  [7SEG-13]
D2  7SEG-CA  [7SEG-13]
IC2  74HC173N  [DIL16]
IC3  74HC173N  [DIL16]
IC7  74LS47N  [DIL16]
IC8  74LS47N  [DIL16]

### Nets
8B_1: IC3.14(D1)
8B_2: IC3.13(D2)
8B_3: IC3.12(D3)
8B_4: IC3.11(D4)
8B_9: IC2.11(D4)
8B_10: IC2.12(D3)
8B_11: IC2.13(D2)
8B_12: IC2.14(D1)
B_1: IC3.3(Q1) IC7.6(ID)
B_2: IC3.4(Q2) IC7.2(IC)
B_3: IC3.5(Q3) IC7.1(IB)
B_4: IC3.6(Q4) IC7.7(IA)
B_5: IC2.3(Q1) IC8.6(ID)
B_6: IC2.4(Q2) IC8.2(IC)
B_7: IC2.5(Q3) IC8.1(IB)
B_8: IC2.6(Q4) IC8.7(IA)
CLK: IC2.7(CLK) IC3.7(CLK)
CLR: IC2.15(CLR) IC3.15(CLR)
GND: D1.3(CA1) D1.5(DP) D1.8(CA2) D2.3(CA1) D2.5(DP) D2.8(CA2) IC2.1(M) IC2.2(N) IC3.1(M) IC3.2(N) IC7.3(LT) IC7.4(BI/RBO) IC7.5(RBI) IC8.3(LT) IC8.4(BI/RBO) IC8.5(RBI)
N$9: D1.7(A) IC7.13(A)
N$10: D1.6(B) IC7.12(B)
N$11: D1.4(C) IC7.11(C)
N$12: D1.2(D) IC7.10(D)
N$13: D1.1(E) IC7.9(E)
N$14: D1.9(F) IC7.15(F)
N$15: D1.10(G) IC7.14(G)
N$16: D2.7(A) IC8.13(A)
N$21: D2.6(B) IC8.12(B)
N$22: D2.4(C) IC8.11(C)
N$23: D2.2(D) IC8.10(D)
N$24: D2.1(E) IC8.9(E)
N$29: D2.9(F) IC8.15(F)
N$30: D2.10(G) IC8.14(G)
|BREAD: IC2.9(G1) IC2.10(G2) IC3.9(G1) IC3.10(G2)

### Power pins joined to a net without a drawn wire
GND: IC2.8(GND) IC3.8(GND) IC7.8(GND) IC8.8(GND)
VCC: IC2.16(VCC) IC3.16(VCC) IC7.16(VCC) IC8.16(VCC)

### Library data of the parts
D1 D2 = special:7SEG-CA: 7-segment DISPLAY single anode, 13 mm
IC2 IC3 = 74xx-eu:74*173: 4-bit D type REGISTER, 3-state
IC7 IC8 = 74xx-eu:74*47: BCD to seven segment DECODER/DRIVER Source: http://www.ee.washington.edu/stores/DataSheets/74ls/74ls47.pdf

## Module ALU
Ports: A_1(io) A_2(io) A_3(io) A_4(io) A_5(io) A_6(io) A_7(io) A_8(io) B_1(io) B_2(io) B_3(io) B_4(io) B_5(io) B_6(io) B_7(io) B_8(io) 8B_1(io) 8B_2(io) 8B_3(io) 8B_4(io) 8B_5(io) 8B_6(io) 8B_7(io) 8B_8(io) CLK(io) CLR(io) GND(io) VCC(io) |ALUWRITE(io) SUB(io) |FI(io) CF(io) ZF(io)
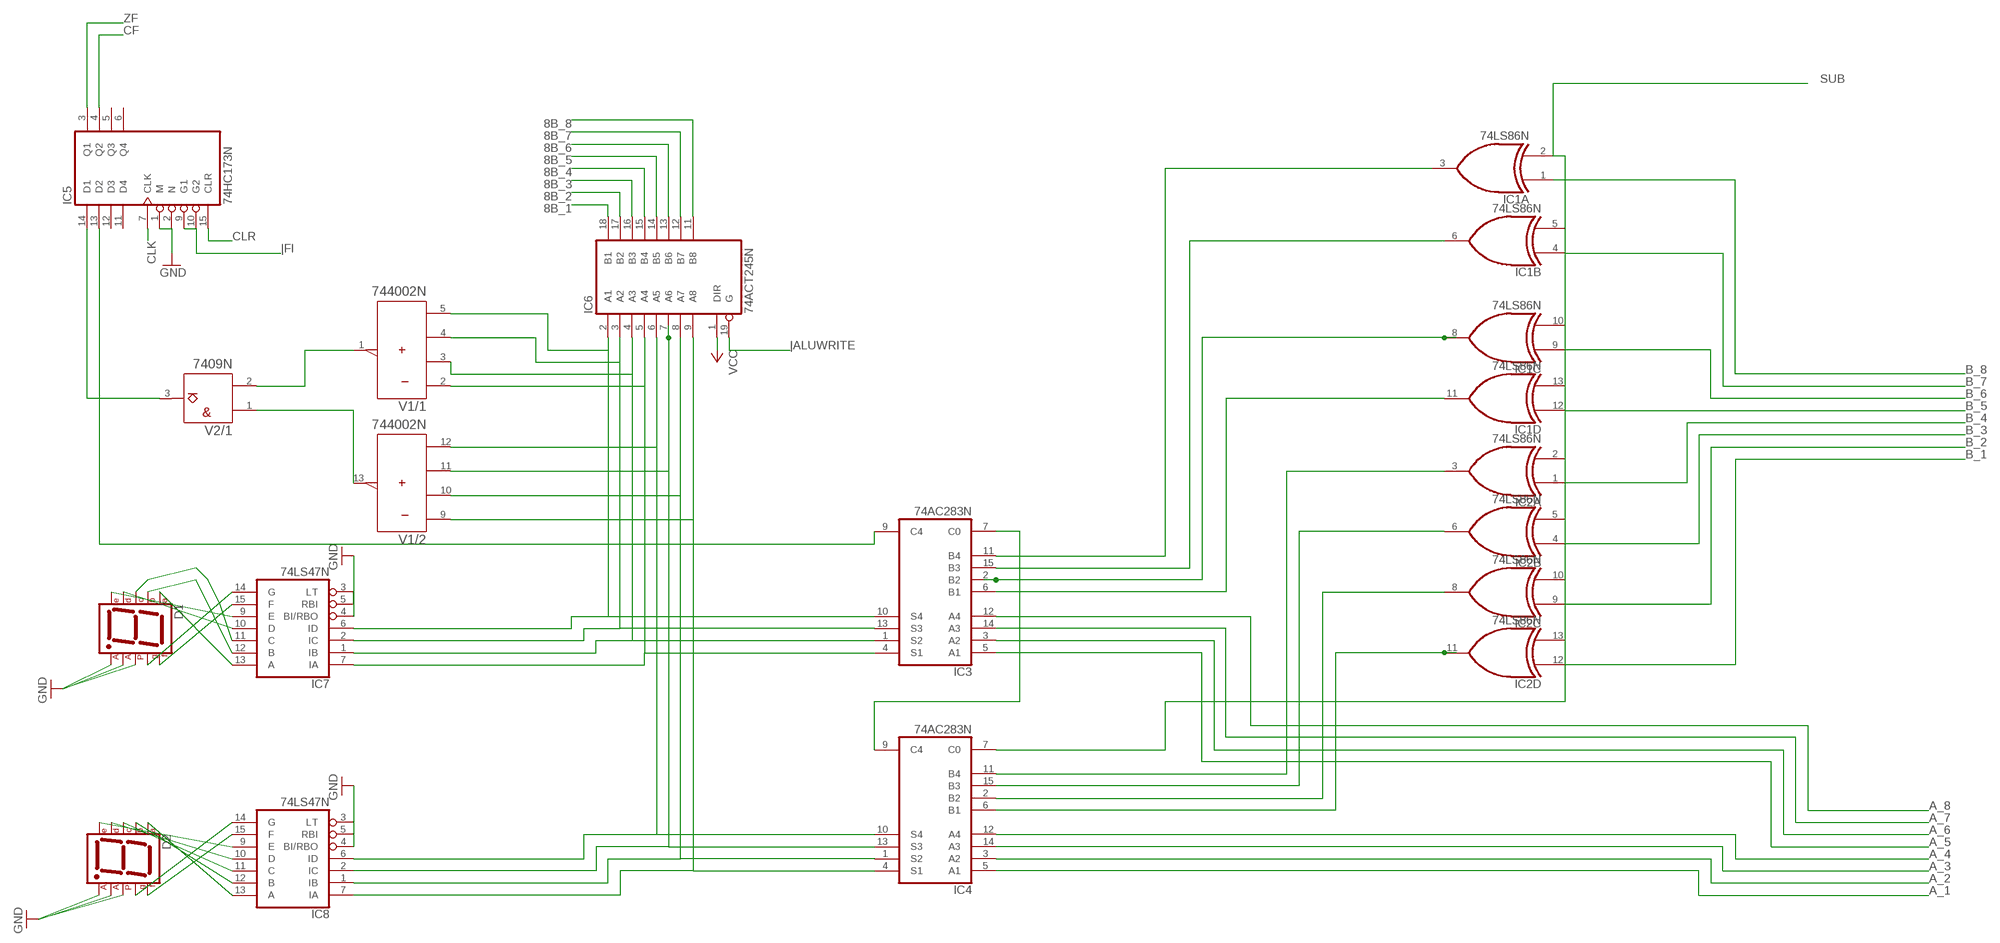
[diagram p5: schematic, module ALU, sheet 1]

### Parts
D1  7SEG-CA  [7SEG-13]
D2  7SEG-CA  [7SEG-13]
IC1  74LS86N  [DIL14]
IC2  74LS86N  [DIL14]
IC3  74AC283N  [DIL16]
IC4  74AC283N  [DIL16]
IC5  74HC173N  [DIL16]
IC6  74ACT245N  [DIL20]
IC7  74LS47N  [DIL16]
IC8  74LS47N  [DIL16]
V1  744002N  [DIL14]
V2  7409N  [DIL14]

### Nets
8B_1: IC6.18(B1)
8B_2: IC6.17(B2)
8B_3: IC6.16(B3)
8B_4: IC6.15(B4)
8B_5: IC6.14(B5)
8B_6: IC6.13(B6)
8B_7: IC6.12(B7)
8B_8: IC6.11(B8)
A_1: IC4.5(A1)
A_2: IC4.3(A2)
A_3: IC4.14(A3)
A_4: IC4.12(A4)
A_5: IC3.5(A1)
A_6: IC3.3(A2)
A_7: IC3.14(A3)
A_8: IC3.12(A4)
A_9: IC4.4(S1) IC6.9(A8) IC8.7(IA) V1.9(/2:A)
A_10: IC4.1(S2) IC6.8(A7) IC8.1(IB) V1.10(/2:B)
A_11: IC4.10(S4) IC6.6(A5) IC8.6(ID) V1.12(/2:D)
A_12: IC4.13(S3) IC6.7(A6) IC8.2(IC) V1.11(/2:C)
A_13: IC3.4(S1) IC6.5(A4) IC7.7(IA) V1.2(/1:A)
A_14: IC3.1(S2) IC6.4(A3) IC7.1(IB) V1.3(/1:B)
A_15: IC3.13(S3) IC6.3(A2) IC7.2(IC) V1.4(/1:C)
A_16: IC3.10(S4) IC6.2(A1) IC7.6(ID) V1.5(/1:D)
B_1: IC2.12(D:I0)
B_2: IC2.9(C:I0)
B_3: IC2.4(B:I0)
B_4: IC2.1(A:I0)
B_5: IC1.12(D:I0)
B_6: IC1.9(C:I0)
B_7: IC1.4(B:I0)
B_8: IC1.1(A:I0)
CF: IC5.4(Q2)
CLK: IC5.7(CLK)
CLR: IC5.15(CLR)
GND: D1.3(CA1) D1.5(DP) D1.8(CA2) D2.3(CA1) D2.5(DP) D2.8(CA2) IC5.1(M) IC5.2(N) IC7.3(LT) IC7.4(BI/RBO) IC7.5(RBI) IC8.3(LT) IC8.4(BI/RBO) IC8.5(RBI)
N$1: IC2.11(D:O) IC4.6(B1)
N$2: IC2.8(C:O) IC4.2(B2)
N$3: IC2.6(B:O) IC4.15(B3)
N$4: IC2.3(A:O) IC4.11(B4)
N$5: IC1.11(D:O) IC3.6(B1)
N$6: IC1.6(B:O) IC3.15(B3)
N$7: IC1.8(C:O) IC3.2(B2)
N$8: IC1.3(A:O) IC3.11(B4)
N$9: IC3.7(C0) IC4.9(C4)
N$10: D1.7(A) IC7.13(A)
N$11: D1.6(B) IC7.12(B)
N$12: D1.4(C) IC7.11(C)
N$13: D1.2(D) IC7.10(D)
N$14: D1.1(E) IC7.9(E)
N$15: D1.9(F) IC7.15(F)
N$16: D1.10(G) IC7.14(G)
N$17: D2.7(A) IC8.13(A)
N$18: V1.1(/1:Y) V2.2(/1:B)
N$19: V1.13(/2:Y) V2.1(/1:A)
N$20: IC5.14(D1) V2.3(/1:Y)
N$21: D2.6(B) IC8.12(B)
N$22: D2.4(C) IC8.11(C)
N$23: D2.2(D) IC8.10(D)
N$24: D2.1(E) IC8.9(E)
N$25: IC3.9(C4) IC5.13(D2)
N$29: D2.9(F) IC8.15(F)
N$30: D2.10(G) IC8.14(G)
SUB: IC1.2(A:I1) IC1.5(B:I1) IC1.10(C:I1) IC1.13(D:I1) IC2.2(A:I1) IC2.5(B:I1) IC2.10(C:I1) IC2.13(D:I1) IC4.7(C0)
VCC: IC6.1(DIR)
ZF: IC5.3(Q1)
|ALUWRITE: IC6.19(G)
|FI: IC5.9(G1) IC5.10(G2)
Unconnected: IC5.5(Q3) IC5.6(Q4) IC5.11(D4) IC5.12(D3) V2.4(/2:A) V2.5(/2:B) V2.6(/2:Y) V2.8(/3:Y) V2.9(/3:A) V2.10(/3:B) V2.11(/4:Y) V2.12(/4:A) V2.13(/4:B)

### Power pins joined to a net without a drawn wire
+UB: V1.14(/+UB:+UB) V2.14(/+UB:+UB)
-UB: V1.7(/-UB:-UB) V2.7(/-UB:-UB)
GND: IC1.7(P:GND) IC2.7(P:GND) IC3.8(GND) IC4.8(GND) IC5.8(GND) IC6.10(GND) IC7.8(GND) IC8.8(GND)
VCC: IC1.14(P:VCC) IC2.14(P:VCC) IC3.16(VCC) IC4.16(VCC) IC5.16(VCC) IC6.20(VCC) IC7.16(VCC) IC8.16(VCC)

### Library data of the parts
D1 D2 = special:7SEG-CA: 7-segment DISPLAY single anode, 13 mm
IC1 IC2 = 74xx-us:74*86: Quad 2-input EXCLUSIV-OR (XOR) gate
IC3 IC4 = 74xx-eu:74*283: 4-bit binary FULL ADDER, fast carry
IC5 = 74xx-eu:74*173: 4-bit D type REGISTER, 3-state
IC6 = 74xx-eu:74*245: Octal BUS TRANSCEIVER, 3-state
IC7 IC8 = 74xx-eu:74*47: BCD to seven segment DECODER/DRIVER Source: http://www.ee.washington.edu/stores/DataSheets/74ls/74ls47.pdf
V1 = 74ttl-din:74*4002: Dual 4-input NOR
V2 = 74ttl-din:74*09: Quad 2-input AND gate, open collector

## Module RAM
Ports: 16B_1(io) 16B_2(io) 16B_3(io) 16B_4(io) 16B_5(io) 16B_7(io) 16B_6(io) 16B_8(io) 16B_10(io) 16B_9(io) 16B_11(io) 16B_12(io) 16B_13(io) 16B_14(io) 16B_15(io) 16B_16(io) 8B_1(io) 8B_2(io) 8B_3(io) 8B_4(io) 8B_5(io) 8B_6(io) 8B_7(io) 8B_8(io) CLK(io) CLR(io) GND(io) RAM_LRS(io) SLC_ADDR(io) |RAM_OUT(io) |RAM_WRITE(io) VCC(io)
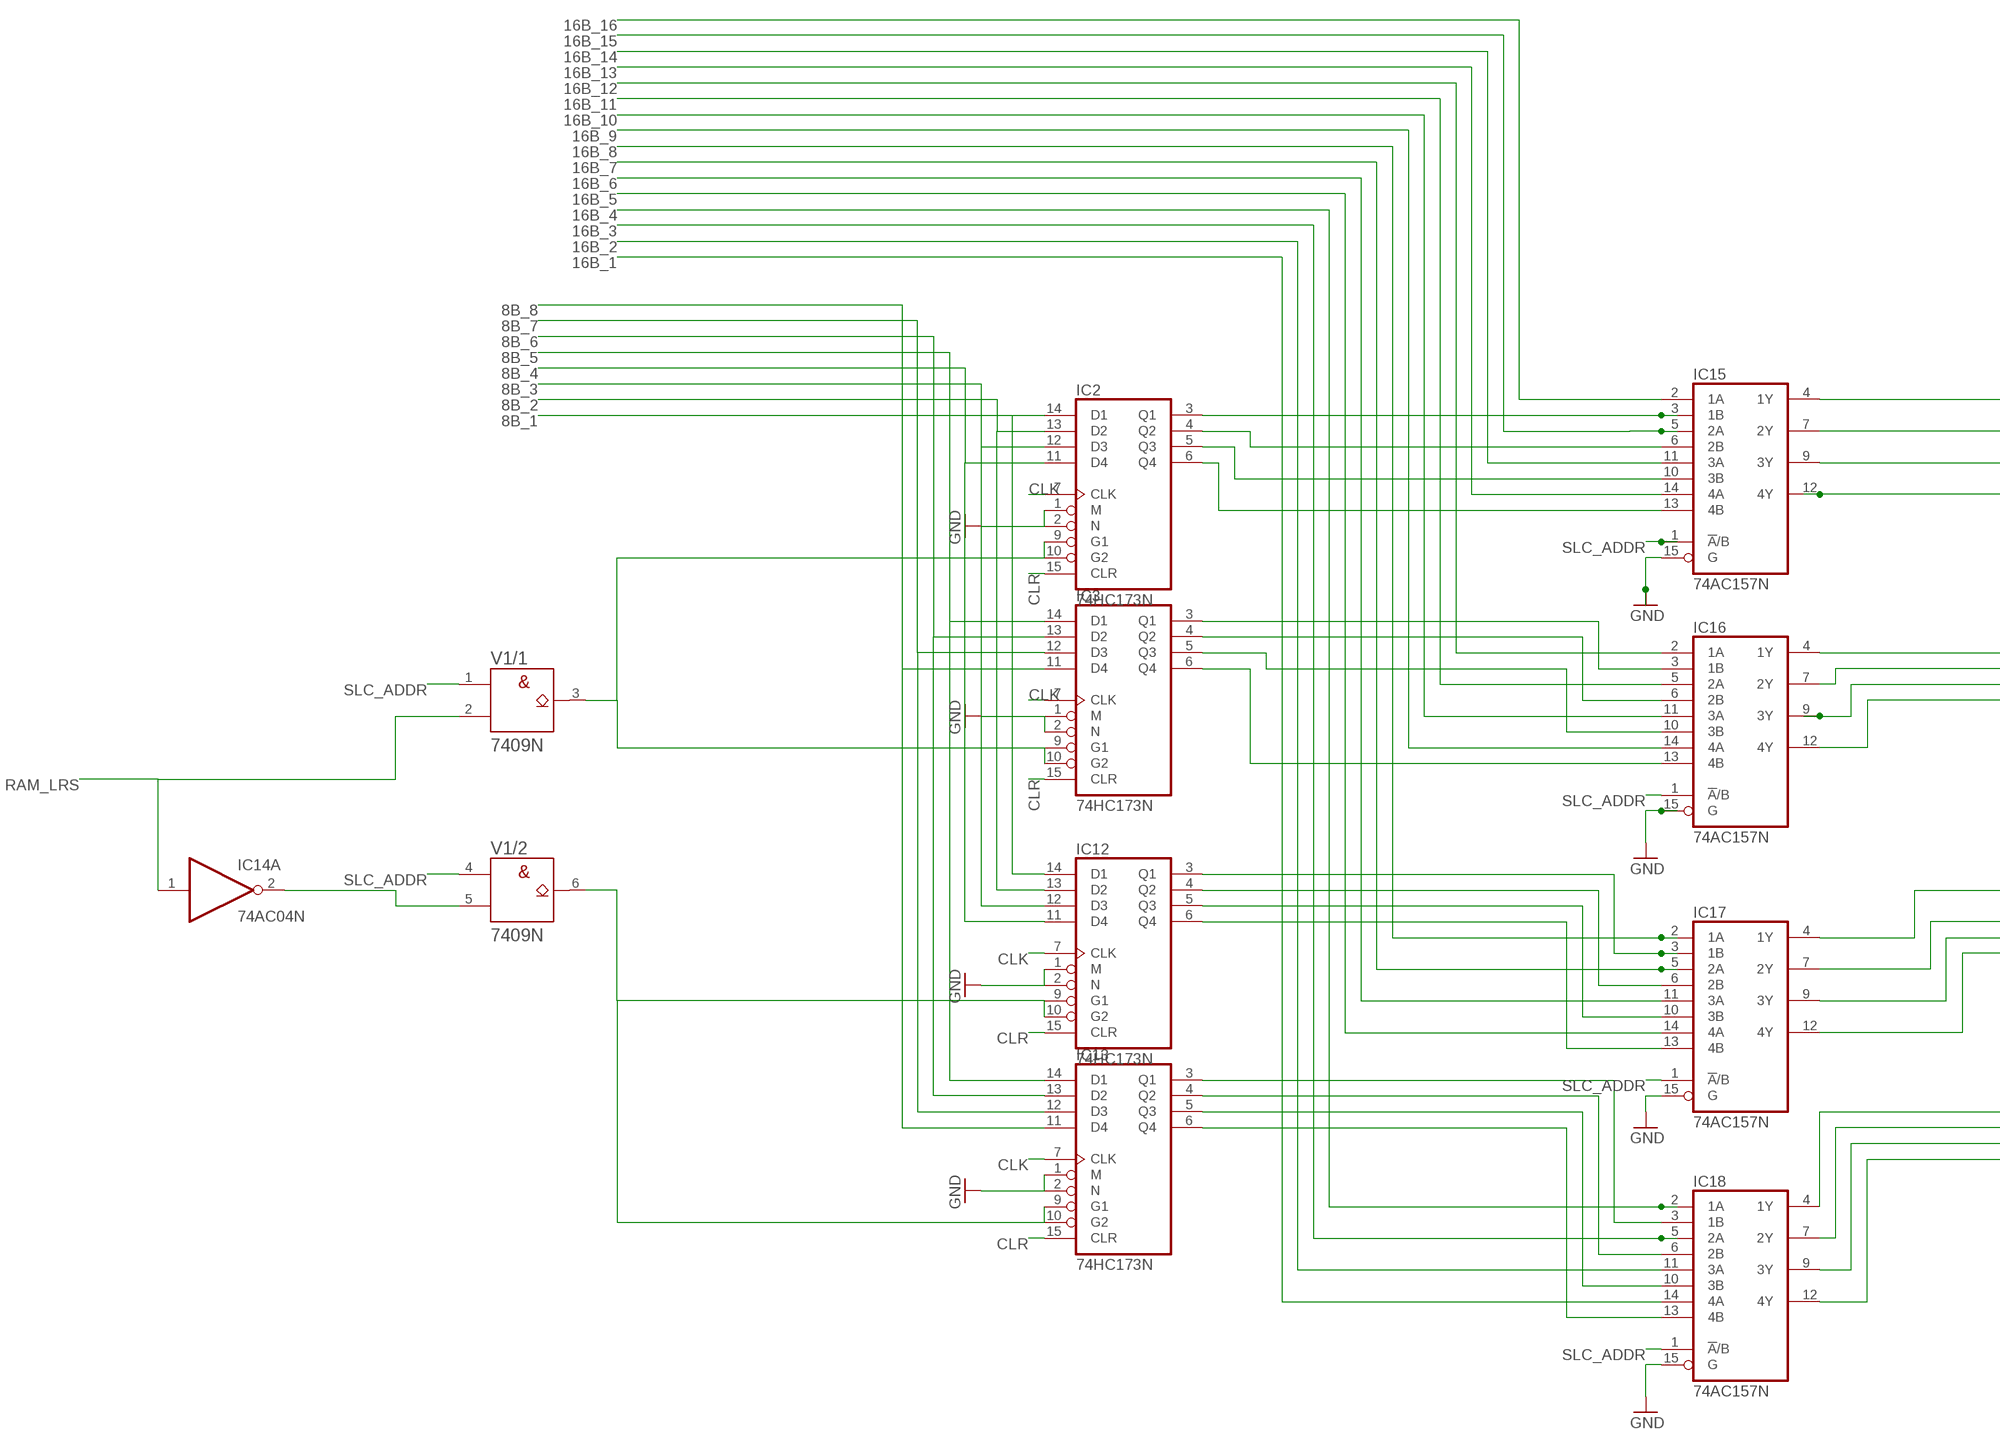
[diagram p6: schematic, module RAM, sheet 1, part 1 of 2]
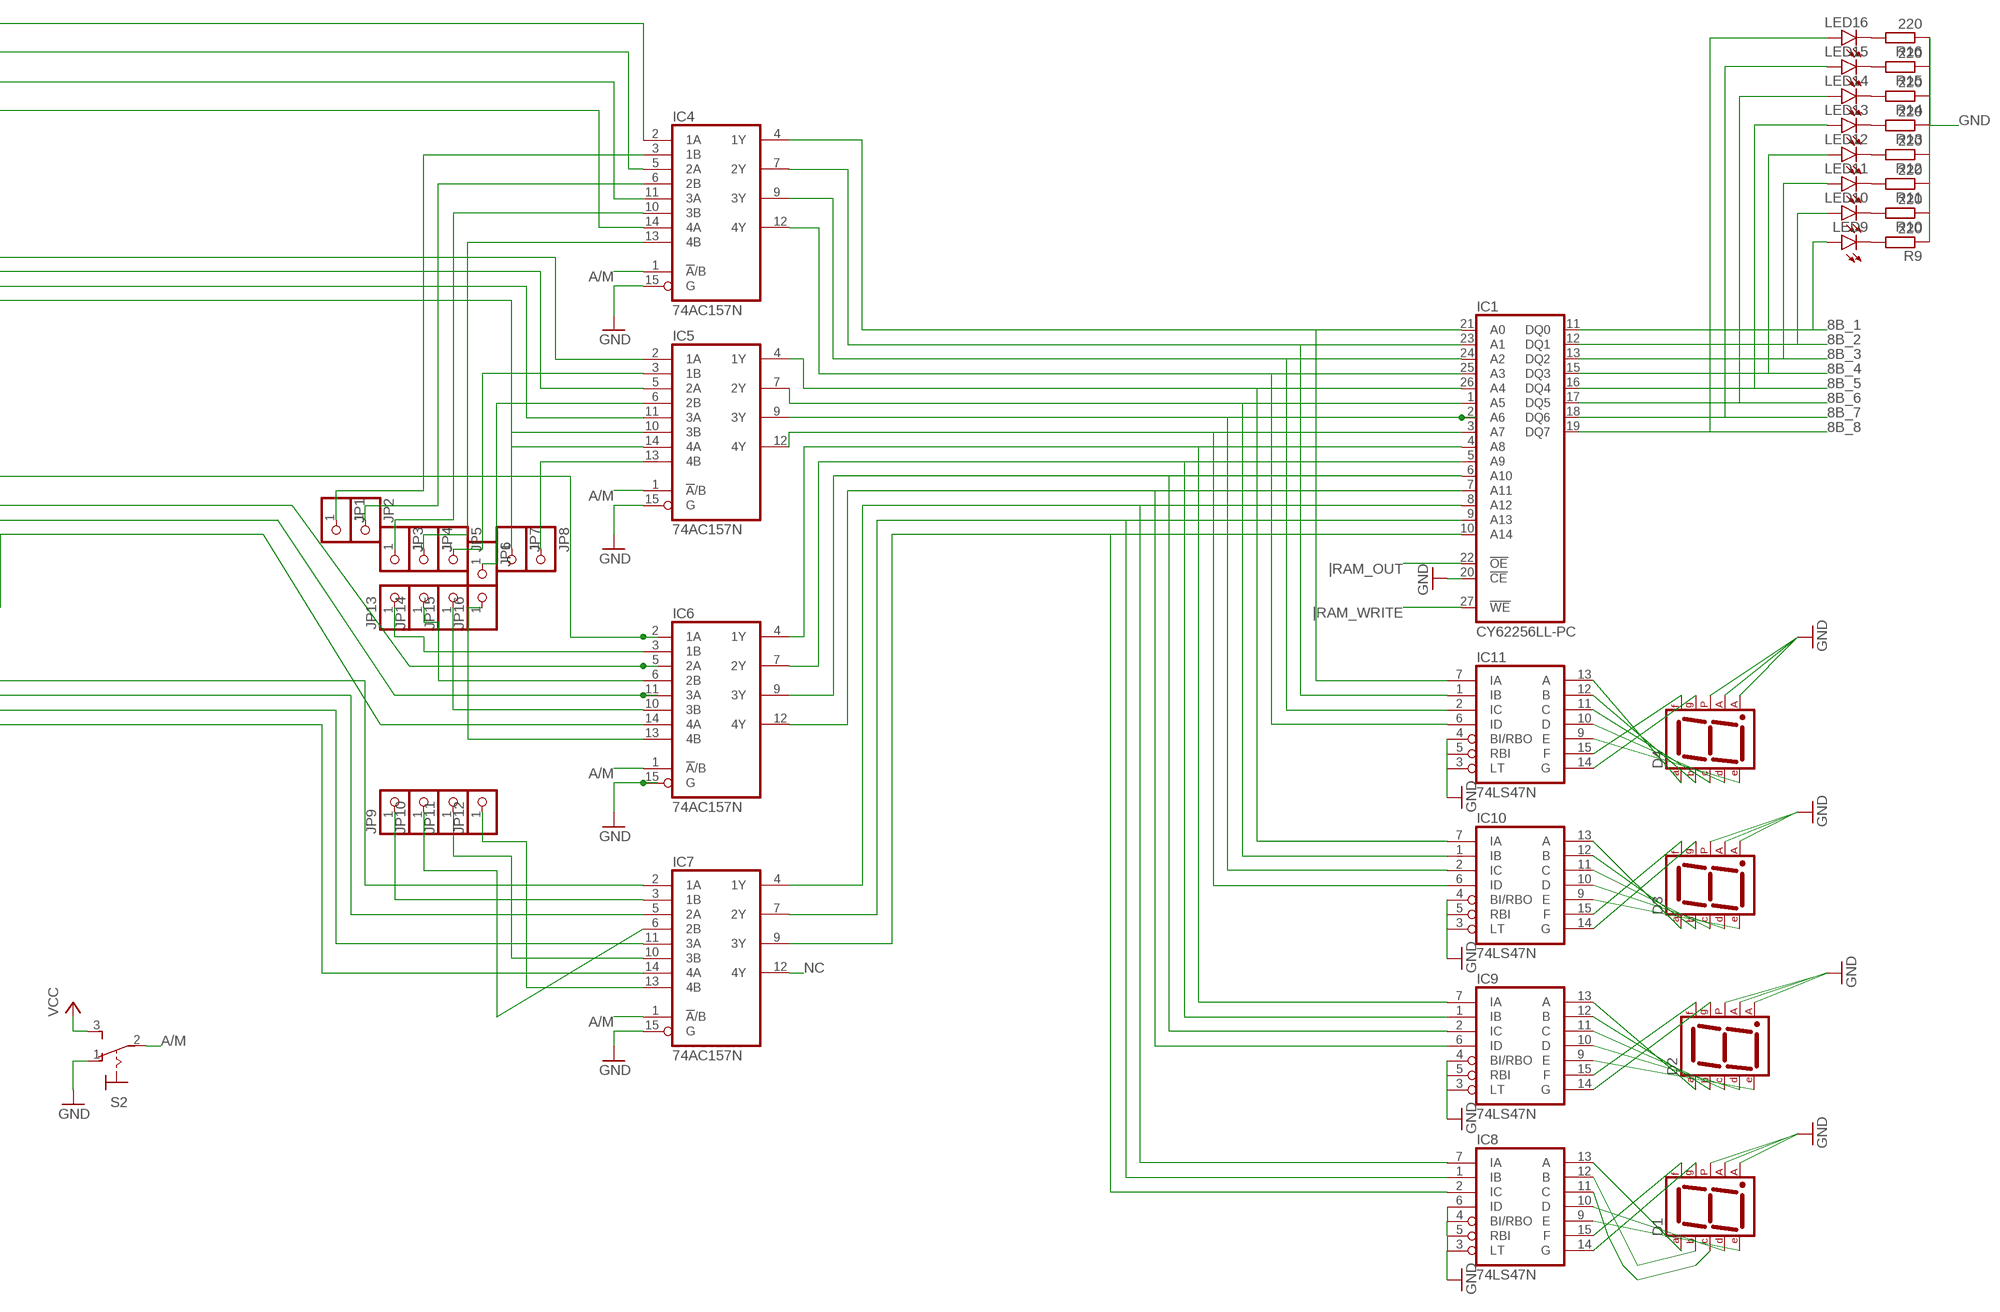
[diagram p7: schematic, module RAM, sheet 1, part 2 of 2]

### Parts
D1  7SEG-CA  [7SEG-13]
D2  7SEG-CA  [7SEG-13]
D3  7SEG-CA  [7SEG-13]
D4  7SEG-CA  [7SEG-13]
IC1  CY62256LL-PC  [DIL28-6]
IC2  74HC173N  [DIL16]
IC3  74HC173N  [DIL16]
IC4  74AC157N  [DIL16]
IC5  74AC157N  [DIL16]
IC6  74AC157N  [DIL16]
IC7  74AC157N  [DIL16]
IC8  74LS47N  [DIL16]
IC9  74LS47N  [DIL16]
IC10  74LS47N  [DIL16]
IC11  74LS47N  [DIL16]
IC12  74HC173N  [DIL16]
IC13  74HC173N  [DIL16]
IC14  74AC04N  [DIL14]
IC15  74AC157N  [DIL16]
IC16  74AC157N  [DIL16]
IC17  74AC157N  [DIL16]
IC18  74AC157N  [DIL16]
JP1  PINHD-1X1  [1X01]
JP2  PINHD-1X1  [1X01]
JP3  PINHD-1X1  [1X01]
JP4  PINHD-1X1  [1X01]
JP5  PINHD-1X1  [1X01]
JP6  PINHD-1X1  [1X01]
JP7  PINHD-1X1  [1X01]
JP8  PINHD-1X1  [1X01]
JP9  PINHD-1X1  [1X01]
JP10  PINHD-1X1  [1X01]
JP11  PINHD-1X1  [1X01]
JP12  PINHD-1X1  [1X01]
JP13  PINHD-1X1  [1X01]
JP14  PINHD-1X1  [1X01]
JP15  PINHD-1X1  [1X01]
JP16  PINHD-1X1  [1X01]
LED9  LED5MM  [LED5MM]
LED10  LED5MM  [LED5MM]
LED11  LED5MM  [LED5MM]
LED12  LED5MM  [LED5MM]
LED13  LED5MM  [LED5MM]
LED14  LED5MM  [LED5MM]
LED15  LED5MM  [LED5MM]
LED16  LED5MM  [LED5MM]
R9  220  R-EU_0204/7  [0204/7]
R10  220  R-EU_0204/7  [0204/7]
R11  220  R-EU_0204/7  [0204/7]
R12  220  R-EU_0204/7  [0204/7]
R13  220  R-EU_0204/7  [0204/7]
R14  220  R-EU_0204/7  [0204/7]
R15  220  R-EU_0204/7  [0204/7]
R16  220  R-EU_0204/7  [0204/7]
S2  320-916  [320-916]
V1  7409N  [DIL14]

### Nets
8B_1: IC1.11(DQ0) IC2.14(D1) IC12.14(D1) LED9.A
8B_2: IC1.12(DQ1) IC2.13(D2) IC12.13(D2) LED10.A
8B_3: IC1.13(DQ2) IC2.12(D3) IC12.12(D3) LED11.A
8B_4: IC1.15(DQ3) IC2.11(D4) IC12.11(D4) LED12.A
8B_5: IC1.16(DQ4) IC3.14(D1) IC13.14(D1) LED13.A
8B_6: IC1.17(DQ5) IC3.13(D2) IC13.13(D2) LED14.A
8B_7: IC1.18(DQ6) IC3.12(D3) IC13.12(D3) LED15.A
8B_8: IC1.19(DQ7) IC3.11(D4) IC13.11(D4) LED16.A
16B_1: IC18.14(4A)
16B_2: IC18.11(3A)
16B_3: IC18.5(2A)
16B_4: IC18.2(1A)
16B_5: IC17.14(4A)
16B_6: IC17.11(3A)
16B_7: IC17.5(2A)
16B_8: IC17.2(1A)
16B_9: IC16.14(4A)
16B_10: IC16.11(3A)
16B_11: IC16.5(2A)
16B_12: IC16.2(1A)
16B_13: IC15.14(4A)
16B_14: IC15.11(3A)
16B_15: IC15.5(2A)
16B_16: IC15.2(1A)
A/M: IC4.1(!A!/B) IC5.1(!A!/B) IC6.1(!A!/B) IC7.1(!A!/B) S2.2(P)
CLK: IC2.7(CLK) IC3.7(CLK) IC12.7(CLK) IC13.7(CLK)
CLR: IC2.15(CLR) IC3.15(CLR) IC12.15(CLR) IC13.15(CLR)
GND: D1.3(CA1) D1.5(DP) D1.8(CA2) D2.3(CA1) D2.5(DP) D2.8(CA2) D3.3(CA1) D3.5(DP) D3.8(CA2) D4.3(CA1) D4.5(DP) D4.8(CA2) IC1.20(!CE) IC2.1(M) IC2.2(N) IC3.1(M) IC3.2(N) IC4.15(G) IC5.15(G) IC6.15(G) IC7.15(G) IC8.3(LT) IC8.4(BI/RBO) IC8.5(RBI) IC8.6(ID) IC9.3(LT) IC9.4(BI/RBO) IC9.5(RBI) IC10.3(LT) IC10.4(BI/RBO) IC10.5(RBI) IC11.3(LT) IC11.4(BI/RBO) IC11.5(RBI) IC12.1(M) IC12.2(N) IC13.1(M) IC13.2(N) IC16.15(G) IC17.15(G) IC18.15(G) R9.1 R10.1 R11.1 R12.1 R13.1 R14.1 R15.1 R16.1 S2.1(O)
N$1: IC12.9(G1) IC12.10(G2) IC13.9(G1) IC13.10(G2) V1.6(/2:Y)
N$2: IC2.9(G1) IC2.10(G2) IC3.9(G1) IC3.10(G2) V1.3(/1:Y)
N$3: IC14.2(A:O) V1.5(/2:B)
N$4: IC4.2(1A) IC15.4(1Y)
N$5: IC4.5(2A) IC15.7(2Y)
N$6: IC4.11(3A) IC15.9(3Y)
N$7: IC4.14(4A) IC15.12(4Y)
N$8: IC5.2(1A) IC16.4(1Y)
N$9: IC5.5(2A) IC16.7(2Y)
N$10: IC5.11(3A) IC16.9(3Y)
N$11: IC5.14(4A) IC16.12(4Y)
N$12: IC6.2(1A) IC17.4(1Y)
N$13: IC6.5(2A) IC17.7(2Y)
N$14: IC6.11(3A) IC17.9(3Y)
N$15: IC6.14(4A) IC17.12(4Y)
N$16: IC7.2(1A) IC18.4(1Y)
N$17: IC7.5(2A) IC18.7(2Y)
N$18: IC7.11(3A) IC18.9(3Y)
N$19: IC7.14(4A) IC18.12(4Y)
N$20: IC4.3(1B) JP1.1
N$21: IC4.6(2B) JP2.1
N$22: IC4.10(3B) JP3.1
N$23: IC4.13(4B) JP4.1
N$24: IC5.3(1B) JP5.1
N$25: IC5.6(2B) JP6.1
N$26: IC5.10(3B) JP7.1
N$27: IC5.13(4B) JP8.1
N$28: IC6.3(1B) JP13.1
N$29: IC6.6(2B) JP14.1
N$30: IC6.10(3B) JP15.1
N$31: IC6.13(4B) JP16.1
N$32: IC7.3(1B) JP9.1
N$33: IC7.6(2B) JP10.1
N$34: IC7.10(3B) JP11.1
N$35: IC7.13(4B) JP12.1
N$36: IC1.21(A0) IC4.4(1Y) IC11.7(IA)
N$37: IC1.23(A1) IC4.7(2Y) IC11.1(IB)
N$38: D1.7(A) IC8.13(A)
N$39: D1.6(B) IC8.12(B)
N$40: IC1.24(A2) IC4.9(3Y) IC11.2(IC)
N$41: IC1.25(A3) IC4.12(4Y) IC11.6(ID)
N$42: IC1.26(A4) IC5.4(1Y) IC10.7(IA)
N$43: IC1.1(A5) IC5.7(2Y) IC10.1(IB)
N$44: IC1.2(A6) IC5.9(3Y) IC10.2(IC)
N$45: IC1.3(A7) IC5.12(4Y) IC10.6(ID)
N$46: IC1.4(A8) IC6.4(1Y) IC9.7(IA)
N$47: IC1.5(A9) IC6.7(2Y) IC9.1(IB)
N$48: IC1.6(A10) IC6.9(3Y) IC9.2(IC)
N$49: IC1.7(A11) IC6.12(4Y) IC9.6(ID)
N$50: IC1.8(A12) IC7.4(1Y) IC8.7(IA)
N$51: IC1.9(A13) IC7.7(2Y) IC8.1(IB)
N$52: IC1.10(A14) IC7.9(3Y) IC8.2(IC)
N$53: IC2.3(Q1) IC15.3(1B)
N$54: D1.4(C) IC8.11(C)
N$55: D1.2(D) IC8.10(D)
N$56: D1.1(E) IC8.9(E)
N$57: D1.9(F) IC8.15(F)
N$58: D1.10(G) IC8.14(G)
N$59: D2.7(A) IC9.13(A)
N$60: D2.6(B) IC9.12(B)
N$61: D2.4(C) IC9.11(C)
N$62: D2.2(D) IC9.10(D)
N$63: D2.1(E) IC9.9(E)
N$64: D2.9(F) IC9.15(F)
N$65: D2.10(G) IC9.14(G)
N$66: D3.7(A) IC10.13(A)
N$67: D3.6(B) IC10.12(B)
N$68: D3.4(C) IC10.11(C)
N$69: D3.2(D) IC10.10(D)
N$70: D3.1(E) IC10.9(E)
N$71: D3.9(F) IC10.15(F)
N$72: D3.10(G) IC10.14(G)
N$73: D4.7(A) IC11.13(A)
N$74: D4.6(B) IC11.12(B)
N$75: D4.4(C) IC11.11(C)
N$76: D4.2(D) IC11.10(D)
N$77: D4.1(E) IC11.9(E)
N$78: D4.9(F) IC11.15(F)
N$79: D4.10(G) IC11.14(G)
N$80: IC2.4(Q2) IC15.6(2B)
N$81: IC2.5(Q3) IC15.10(3B)
N$82: IC2.6(Q4) IC15.13(4B)
N$83: IC3.3(Q1) IC16.3(1B)
N$84: IC3.4(Q2) IC16.6(2B)
N$85: IC3.5(Q3) IC16.10(3B)
N$86: IC3.6(Q4) IC16.13(4B)
N$87: IC12.3(Q1) IC17.3(1B)
N$88: IC12.4(Q2) IC17.6(2B)
N$89: IC12.5(Q3) IC17.10(3B)
N$90: IC12.6(Q4) IC17.13(4B)
N$91: IC13.3(Q1) IC18.3(1B)
N$92: IC13.4(Q2) IC18.6(2B)
N$93: IC13.5(Q3) IC18.10(3B)
N$94: IC13.6(Q4) IC18.13(4B)
N$95: LED9.K(C) R9.2
N$96: LED10.K(C) R10.2
N$97: LED11.K(C) R11.2
N$98: LED12.K(C) R12.2
N$99: LED13.K(C) R13.2
N$100: LED14.K(C) R14.2
N$101: LED15.K(C) R15.2
N$102: LED16.K(C) R16.2
N$111: IC15.15(G) ; supply symbol labelled GND
NC: IC7.12(4Y)
RAM_LRS: IC14.1(A:I) V1.2(/1:B)
SLC_ADDR: IC15.1(!A!/B) IC16.1(!A!/B) IC17.1(!A!/B) IC18.1(!A!/B) V1.1(/1:A) V1.4(/2:A)
VCC: S2.3(S)
|RAM_OUT: IC1.22(!OE)
|RAM_WRITE: IC1.27(!WE)
Unconnected: IC14.3(B:I) IC14.4(B:O) IC14.5(C:I) IC14.6(C:O) IC14.8(D:O) IC14.9(D:I) IC14.10(E:O) IC14.11(E:I) IC14.12(F:O) IC14.13(F:I) V1.8(/3:Y) V1.9(/3:A) V1.10(/3:B) V1.11(/4:Y) V1.12(/4:A) V1.13(/4:B)

### Power pins joined to a net without a drawn wire
+UB: V1.14(/+UB:+UB)
-UB: V1.7(/-UB:-UB)
GND: IC1.14(GND) IC2.8(GND) IC3.8(GND) IC4.8(GND) IC5.8(GND) IC6.8(GND) IC7.8(GND) IC8.8(GND) IC9.8(GND) IC10.8(GND) IC11.8(GND) IC12.8(GND) IC13.8(GND) IC14.7(P:GND) IC15.8(GND) IC16.8(GND) IC17.8(GND) IC18.8(GND)
VCC: IC1.28(VCC) IC2.16(VCC) IC3.16(VCC) IC4.16(VCC) IC5.16(VCC) IC6.16(VCC) IC7.16(VCC) IC8.16(VCC) IC9.16(VCC) IC10.16(VCC) IC11.16(VCC) IC12.16(VCC) IC13.16(VCC) IC14.14(P:VCC) IC15.16(VCC) IC16.16(VCC) IC17.16(VCC) IC18.16(VCC)

### Library data of the parts
D1-D4 = special:7SEG-CA: 7-segment DISPLAY single anode, 13 mm
IC1 = memory-sram:CY62256LL-?*: 256K (32K x 8) CMOS-Static RAM Source: http://download.cypress.com.edgesuite.net/design_resources/datasheets/contents/cy62256_8.pdf
IC2 IC3 IC12 IC13 = 74xx-eu:74*173: 4-bit D type REGISTER, 3-state
IC4-IC7 IC15-IC18 = 74xx-eu:74*157: Quadruple 2-line to 1-line data SELECTOR/MULTIPLEXER
IC8-IC11 = 74xx-eu:74*47: BCD to seven segment DECODER/DRIVER Source: http://www.ee.washington.edu/stores/DataSheets/74ls/74ls47.pdf
IC14 = 74xx-eu:74*04: Hex INVERTER
JP1-JP16 = pinhead:PINHD-1X1: PIN HEADER
LED9-LED16 = led:LED: LED OSRAM: - CHIPLED LG R971, LG N971, LY N971, LG Q971, LY Q971, LO R971, LY R971 LH N974, LH R974 LS Q976, LO Q976, LY Q976 LO Q996 - Hyper CHIPLED LW Q18S LB Q993, LB Q99A, LB R99A - SideLED LS A670, LO A670, LY A670, LG A670, LP A670 LB A673, LV A673, LT A673, LW A673 LH A674 LY A675 LS A676, LA A676, LO A676, LY A676, LW A676 LS A679, LY A679, LG A679 - Hyper Micro SIDELED® LS Y876, LA Y876, LO Y876, LY Y876 LT Y87S - SmartLED LW L88C, LW L88S LB L89C, LB L89S, LG L890 LS L89K, LO L89K, LY L89K LS L896, LA L896, LO L896, LY L896 - TOPLED LS T670, LO T670, LY T670, LG T670, LP T670 LSG T670, LSP T670, LSY T670, LOP T670, LYG T670 LG T671, LOG T671, LSG T671 LB T673, LV T673, LT T673, LW T673 LH T674 LS T676, LA T676, LO T676, LY T676, LB T676, LH T676, LSB T676, LW T676 LB T67C, LV T67C, LT T67C, LS T67K, LO T67K, LY T67K, LW E67C LS E67B, LA E67B, LO E67B, LY E67B, LB E67C, LV E67C, LT E67C LW T67C LS T679, LY T679, LG T679 LS T770, LO T770, LY T770, LG T770, LP T770 LB T773, LV T773, LT T773, LW T773 LH T774 LS E675, LA E675, LY E675, LS T675 LS T776, LA T776, LO T776, LY T776, LB T776 LHGB T686 LT T68C, LB T68C - Hyper Mini TOPLED® LB M676 - Mini TOPLED Santana® LG M470 LS M47K, LO M47K, LY M47K Source: http://www.osram.convergy.de LUXEON: - LUMILED® LXK2-PW12-R00, LXK2-PW12-S00, LXK2-PW14-U00, LXK2-PW14-V00 LXK2-PM12-R00, LXK2-PM12-S00, LXK2-PM14-U00 LXK2-PE12-Q00, LXK2-PE12-R00, LXK2-PE12-S00, LXK2-PE14-T00, LXK2-PE14-U00 LXK2-PB12-K00, LXK2-PB12-L00, LXK2-PB12-M00, LXK2-PB14-N00, LXK2-PB14-P00, LXK2-PB14-Q00 LXK2-PR12-L00, LXK2-PR12-M00, LXK2-PR14-Q00, LXK2-PR14-R00 LXK2-PD12-Q00, LXK2-PD12-R00, LXK2-PD12-S00 LXK2-PH12-R00, LXK2-PH12-S00 LXK2-PL12-P00, LXK2-PL12-Q00, LXK2-PL12-R00 Source: www.luxeon.com KINGBRIGHT: KA-3528ASYC Source: www.kingbright.com
R9-R16 = rcl:R-EU_: RESISTOR, European symbol; SPICEPREFIX: R
S2 = switch:320-916: TOGGLE SWITCH distributor RS Components
V1 = 74ttl-din:74*09: Quad 2-input AND gate, open collector

## Module INST_REGISTER
Ports: CLK(io) CLR(io) GND(io) 8B_1(io) 8B_2(io) 8B_3(io) 8B_4(io) 8B_5(io) 8B_6(io) 8B_7(io) 8B_8(io) |INSTREAD(io) INST_2(io) INST_3(io) INST_4(io) INST_5(io) INST_6(io) INST_7(io) INST_8(io) |AREAD(io) |BREAD(io) |REG_READ(io)
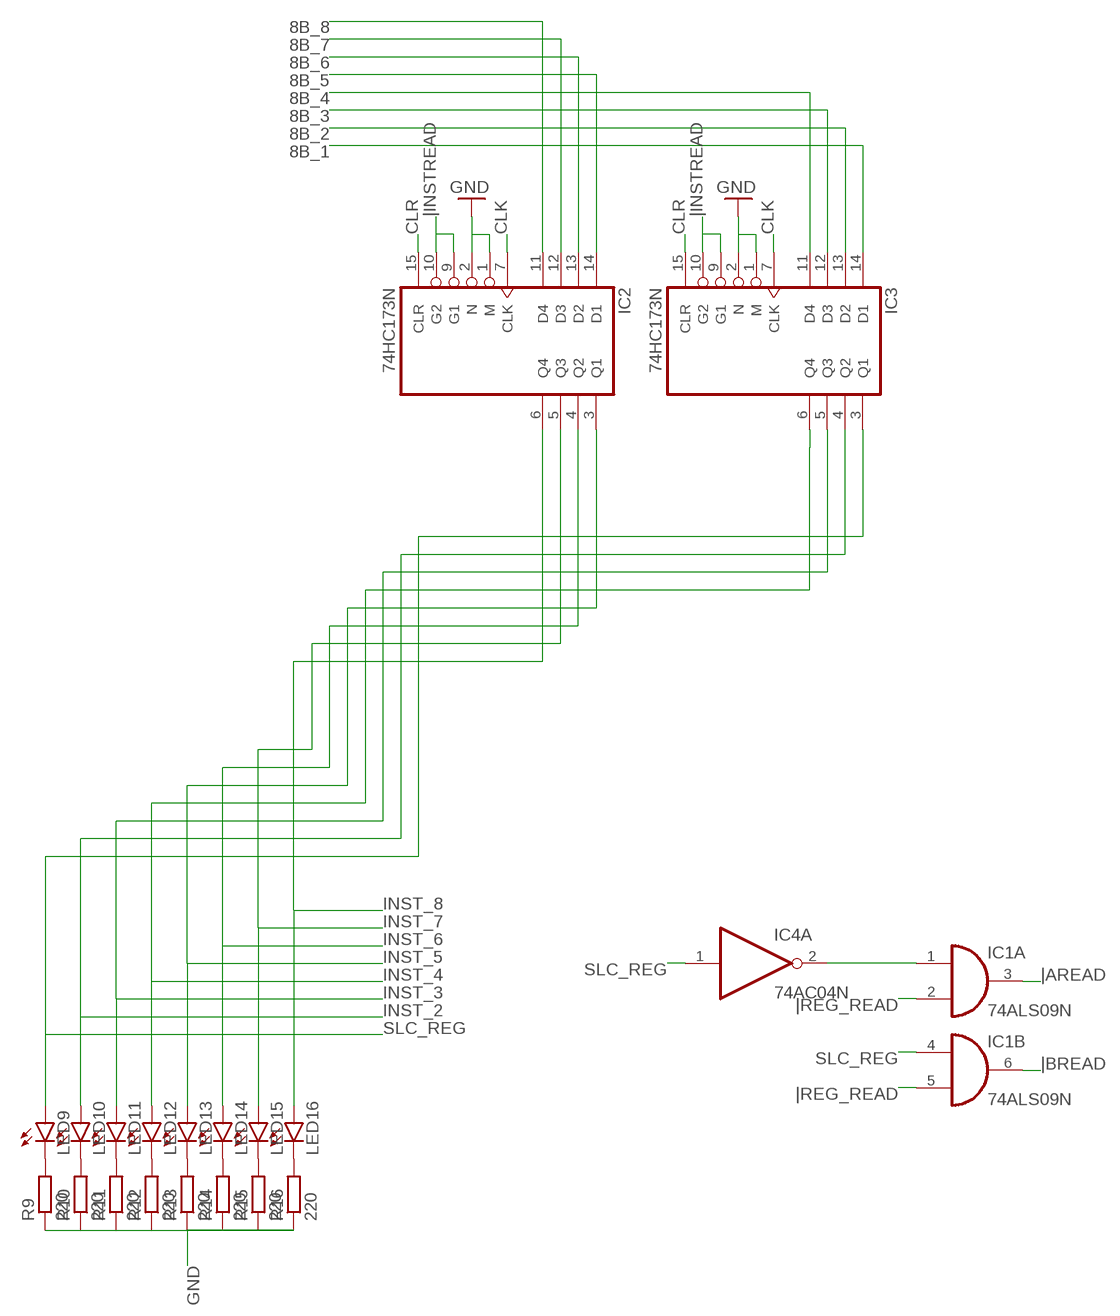
[diagram p8: schematic, module INST_REGISTER, sheet 1]

### Parts
IC1  74ALS09N  [DIL14]
IC2  74HC173N  [DIL16]
IC3  74HC173N  [DIL16]
IC4  74AC04N  [DIL14]
LED9  LED5MM  [LED5MM]
LED10  LED5MM  [LED5MM]
LED11  LED5MM  [LED5MM]
LED12  LED5MM  [LED5MM]
LED13  LED5MM  [LED5MM]
LED14  LED5MM  [LED5MM]
LED15  LED5MM  [LED5MM]
LED16  LED5MM  [LED5MM]
R9  220  R-EU_0204/7  [0204/7]
R10  220  R-EU_0204/7  [0204/7]
R11  220  R-EU_0204/7  [0204/7]
R12  220  R-EU_0204/7  [0204/7]
R13  220  R-EU_0204/7  [0204/7]
R14  220  R-EU_0204/7  [0204/7]
R15  220  R-EU_0204/7  [0204/7]
R16  220  R-EU_0204/7  [0204/7]

### Nets
8B_1: IC3.14(D1)
8B_2: IC3.13(D2)
8B_3: IC3.12(D3)
8B_4: IC3.11(D4)
8B_9: IC2.11(D4)
8B_10: IC2.12(D3)
8B_11: IC2.13(D2)
8B_12: IC2.14(D1)
CLK: IC2.7(CLK) IC3.7(CLK)
CLR: IC2.15(CLR) IC3.15(CLR)
GND: IC2.1(M) IC2.2(N) IC3.1(M) IC3.2(N) R9.1 R10.1 R11.1 R12.1 R13.1 R14.1 R15.1 R16.1
INST_2: IC3.4(Q2) LED10.A
INST_3: IC3.5(Q3) LED11.A
INST_4: IC3.6(Q4) LED12.A
INST_5: IC2.3(Q1) LED13.A
INST_6: IC2.4(Q2) LED14.A
INST_7: IC2.5(Q3) LED15.A
INST_8: IC2.6(Q4) LED16.A
N$1: LED9.K(C) R9.2
N$2: LED10.K(C) R10.2
N$3: LED11.K(C) R11.2
N$4: IC1.1(A:I0) IC4.2(A:O)
N$5: LED12.K(C) R12.2
N$6: LED13.K(C) R13.2
N$7: LED14.K(C) R14.2
N$8: LED15.K(C) R15.2
N$9: LED16.K(C) R16.2
SLC_REG: IC1.4(B:I0) IC3.3(Q1) IC4.1(A:I) LED9.A
|AREAD: IC1.3(A:O)
|BREAD: IC1.6(B:O)
|INSTREAD: IC2.9(G1) IC2.10(G2) IC3.9(G1) IC3.10(G2)
|REG_READ: IC1.2(A:I1) IC1.5(B:I1)
Unconnected: IC1.8(C:O) IC1.9(C:I0) IC1.10(C:I1) IC1.11(D:O) IC1.12(D:I0) IC1.13(D:I1) IC4.3(B:I) IC4.4(B:O) IC4.5(C:I) IC4.6(C:O) IC4.8(D:O) IC4.9(D:I) IC4.10(E:O) IC4.11(E:I) IC4.12(F:O) IC4.13(F:I)

### Power pins joined to a net without a drawn wire
GND: IC1.7(P:GND) IC2.8(GND) IC3.8(GND) IC4.7(P:GND)
VCC: IC1.14(P:VCC) IC2.16(VCC) IC3.16(VCC) IC4.14(P:VCC)

### Library data of the parts
IC1 = 74xx-eu:74*09: Quad 2-input AND gate, open collector
IC2 IC3 = 74xx-eu:74*173: 4-bit D type REGISTER, 3-state
IC4 = 74xx-eu:74*04: Hex INVERTER
LED9-LED16 = led:LED: LED OSRAM: - CHIPLED LG R971, LG N971, LY N971, LG Q971, LY Q971, LO R971, LY R971 LH N974, LH R974 LS Q976, LO Q976, LY Q976 LO Q996 - Hyper CHIPLED LW Q18S LB Q993, LB Q99A, LB R99A - SideLED LS A670, LO A670, LY A670, LG A670, LP A670 LB A673, LV A673, LT A673, LW A673 LH A674 LY A675 LS A676, LA A676, LO A676, LY A676, LW A676 LS A679, LY A679, LG A679 - Hyper Micro SIDELED® LS Y876, LA Y876, LO Y876, LY Y876 LT Y87S - SmartLED LW L88C, LW L88S LB L89C, LB L89S, LG L890 LS L89K, LO L89K, LY L89K LS L896, LA L896, LO L896, LY L896 - TOPLED LS T670, LO T670, LY T670, LG T670, LP T670 LSG T670, LSP T670, LSY T670, LOP T670, LYG T670 LG T671, LOG T671, LSG T671 LB T673, LV T673, LT T673, LW T673 LH T674 LS T676, LA T676, LO T676, LY T676, LB T676, LH T676, LSB T676, LW T676 LB T67C, LV T67C, LT T67C, LS T67K, LO T67K, LY T67K, LW E67C LS E67B, LA E67B, LO E67B, LY E67B, LB E67C, LV E67C, LT E67C LW T67C LS T679, LY T679, LG T679 LS T770, LO T770, LY T770, LG T770, LP T770 LB T773, LV T773, LT T773, LW T773 LH T774 LS E675, LA E675, LY E675, LS T675 LS T776, LA T776, LO T776, LY T776, LB T776 LHGB T686 LT T68C, LB T68C - Hyper Mini TOPLED® LB M676 - Mini TOPLED Santana® LG M470 LS M47K, LO M47K, LY M47K Source: http://www.osram.convergy.de LUXEON: - LUMILED® LXK2-PW12-R00, LXK2-PW12-S00, LXK2-PW14-U00, LXK2-PW14-V00 LXK2-PM12-R00, LXK2-PM12-S00, LXK2-PM14-U00 LXK2-PE12-Q00, LXK2-PE12-R00, LXK2-PE12-S00, LXK2-PE14-T00, LXK2-PE14-U00 LXK2-PB12-K00, LXK2-PB12-L00, LXK2-PB12-M00, LXK2-PB14-N00, LXK2-PB14-P00, LXK2-PB14-Q00 LXK2-PR12-L00, LXK2-PR12-M00, LXK2-PR14-Q00, LXK2-PR14-R00 LXK2-PD12-Q00, LXK2-PD12-R00, LXK2-PD12-S00 LXK2-PH12-R00, LXK2-PH12-S00 LXK2-PL12-P00, LXK2-PL12-Q00, LXK2-PL12-R00 Source: www.luxeon.com KINGBRIGHT: KA-3528ASYC Source: www.kingbright.com
R9-R16 = rcl:R-EU_: RESISTOR, European symbol; SPICEPREFIX: R

## Module CONTROL_LOGIC
Ports: CLK(io) INST_3(io) INST_4(io) INST_6(io) INST_5(io) INST_7(io) INST_8(io) CF(io) ZF(io) GND(io) VCC(io) HLT(io) |REG_READ(io) |AWRITE(io) |FL(io) |ALUWRITE(io) ALUSUB(io) PC_LE(io) PC_LRS(io) RAM_LRS(io) SLC_ADDR(io) |RAM_OUT(io) |INSTREAD(io) COUNT(io) CLR(io) |CLR(io)
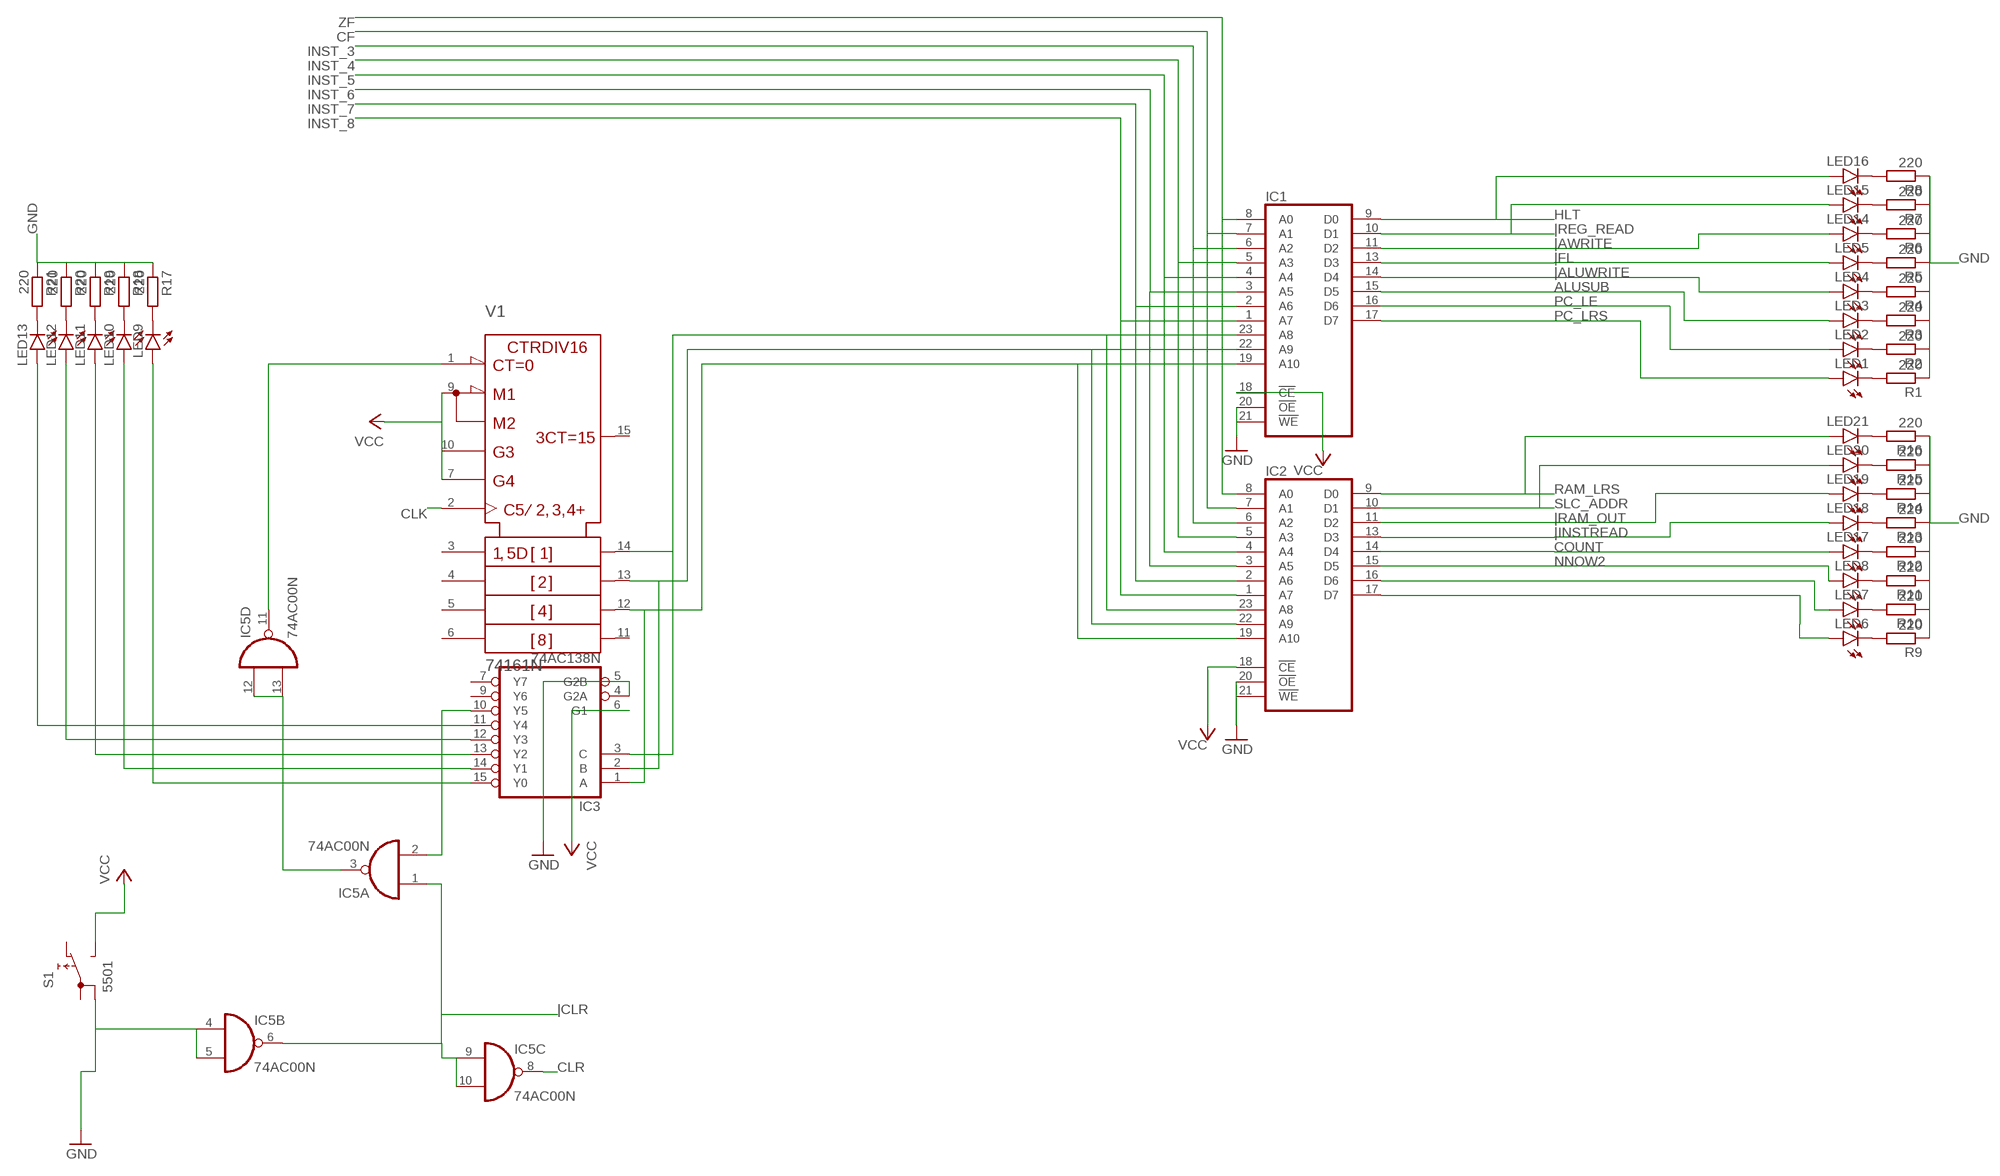
[diagram p9: schematic, module CONTROL_LOGIC, sheet 1]

### Parts
IC1  2816  [DIL24]
IC2  2816  [DIL24]
IC3  74AC138N  [DIL16]
IC5  74AC00N  [DIL14]
LED1  LED5MM  [LED5MM]
LED2  LED5MM  [LED5MM]
LED3  LED5MM  [LED5MM]
LED4  LED5MM  [LED5MM]
LED5  LED5MM  [LED5MM]
LED6  LED5MM  [LED5MM]
LED7  LED5MM  [LED5MM]
LED8  LED5MM  [LED5MM]
LED9  LED5MM  [LED5MM]
LED10  LED5MM  [LED5MM]
LED11  LED5MM  [LED5MM]
LED12  LED5MM  [LED5MM]
LED13  LED5MM  [LED5MM]
LED14  LED5MM  [LED5MM]
LED15  LED5MM  [LED5MM]
LED16  LED5MM  [LED5MM]
LED17  LED5MM  [LED5MM]
LED18  LED5MM  [LED5MM]
LED19  LED5MM  [LED5MM]
LED20  LED5MM  [LED5MM]
LED21  LED5MM  [LED5MM]
R1  220  R-EU_0204/7  [0204/7]
R2  220  R-EU_0204/7  [0204/7]
R3  220  R-EU_0204/7  [0204/7]
R4  220  R-EU_0204/7  [0204/7]
R5  220  R-EU_0204/7  [0204/7]
R6  220  R-EU_0204/7  [0204/7]
R7  220  R-EU_0204/7  [0204/7]
R8  220  R-EU_0204/7  [0204/7]
R9  220  R-EU_0204/7  [0204/7]
R10  220  R-EU_0204/7  [0204/7]
R11  220  R-EU_0204/7  [0204/7]
R12  220  R-EU_0204/7  [0204/7]
R13  220  R-EU_0204/7  [0204/7]
R14  220  R-EU_0204/7  [0204/7]
R15  220  R-EU_0204/7  [0204/7]
R16  220  R-EU_0204/7  [0204/7]
R17  220  R-EU_0204/7  [0204/7]
R18  220  R-EU_0204/7  [0204/7]
R19  220  R-EU_0204/7  [0204/7]
R20  220  R-EU_0204/7  [0204/7]
R21  220  R-EU_0204/7  [0204/7]
S1  5501  [5501]
V1  74161N  [DIL16]

### Nets
ALUSUB: IC1.15(D5) LED3.A
CF: IC1.7(A1) IC2.7(A1)
CLK: V1.2(CLK)
CLR: IC5.8(C:O)
COUNT: IC2.14(D4) LED17.A
GND: IC1.20(!OE) IC1.21(!WE) IC2.20(!OE) IC2.21(!WE) IC3.4(G2A) IC3.5(G2B) IC5.4(B:I0) IC5.5(B:I1) R1.1 R2.1 R3.1 R4.1 R5.1 R6.1 R7.1 R8.1 R9.1 R10.1 R11.1 R12.1 R13.1 R14.1 R15.1 R16.1 R17.1 R18.1 R19.1 R20.1 R21.1 S1.1B
HLT: IC1.9(D0) LED16.A
INST_3: IC1.6(A2) IC2.6(A2)
INST_4: IC1.5(A3) IC2.5(A3)
INST_5: IC1.4(A4) IC2.4(A4)
INST_6: IC1.3(A5) IC2.3(A5)
INST_7: IC1.2(A6) IC2.2(A6)
INST_8: IC1.1(A7) IC2.1(A7)
N$1: IC1.19(A10) IC2.19(A10) IC3.1(A) V1.12(QC)
N$2: IC1.22(A9) IC2.22(A9) IC3.2(B) V1.13(QB)
N$3: IC1.23(A8) IC2.23(A8) IC3.3(C) V1.14(QA)
N$4: IC3.10(Y5) IC5.2(A:I1)
N$5: IC3.15(Y0) LED9.A
N$6: IC3.14(Y1) LED10.A
N$7: IC5.3(A:O) IC5.12(D:I0) IC5.13(D:I1)
N$8: IC5.11(D:O) V1.1(!CLR)
N$9: IC3.13(Y2) LED11.A
N$10: IC3.12(Y3) LED12.A
N$11: IC3.11(Y4) LED13.A
N$12: LED6.K(C) R9.2
N$13: LED7.K(C) R10.2
N$14: LED8.K(C) R11.2
N$15: LED17.K(C) R12.2
N$16: LED18.K(C) R13.2
N$17: LED19.K(C) R14.2
N$18: LED20.K(C) R15.2
N$19: LED21.K(C) R16.2
N$20: LED1.K(C) R1.2
N$21: LED2.K(C) R2.2
N$22: LED3.K(C) R3.2
N$23: LED4.K(C) R4.2
N$24: LED5.K(C) R5.2
N$25: LED14.K(C) R6.2
N$26: LED15.K(C) R7.2
N$27: IC2.17(D7) LED6.A
N$28: LED16.K(C) R8.2
N$29: LED9.K(C) R17.2
N$30: LED10.K(C) R18.2
N$31: LED11.K(C) R19.2
N$32: LED12.K(C) R20.2
N$33: LED13.K(C) R21.2
NNOW: IC2.16(D6) LED7.A
NNOW2: IC2.15(D5) LED8.A
PC_LE: IC1.16(D6) LED2.A
PC_LRS: IC1.17(D7) LED1.A
RAM_LRS: IC2.9(D0) LED21.A
SLC_ADDR: IC2.10(D1) LED20.A
VCC: IC1.18(!CE) IC2.18(!CE) IC3.6(G1) S1.NO V1.7(ENP) V1.9(!LOAD) V1.10(ENT)
ZF: IC1.8(A0) IC2.8(A0)
|ALUWRITE: IC1.14(D4) LED4.A
|AWRITE: IC1.11(D2) LED14.A
|CLR: IC5.1(A:I0) IC5.6(B:O) IC5.9(C:I0) IC5.10(C:I1)
|FL: IC1.13(D3) LED5.A
|INSTREAD: IC2.13(D3) LED18.A
|RAM_OUT: IC2.11(D2) LED19.A
|REG_READ: IC1.10(D1) LED15.A
Unconnected: IC3.7(Y7) IC3.9(Y6) S1.1A S1.NC V1.3(A) V1.4(B) V1.5(C) V1.6(D) V1.11(QD) V1.15(RCO)

### Power pins joined to a net without a drawn wire
+UB: V1.16(+UB)
-UB: V1.8(-UB)
GND: IC1.12(GND) IC2.12(GND) IC3.8(GND) IC5.7(P:GND)
VCC: IC1.24(VCC) IC2.24(VCC) IC3.16(VCC) IC5.14(P:VCC)

### Library data of the parts
IC1 IC2 = memory:2816: MEMORY
IC3 = 74xx-eu:74*138: 3-line to 8-line DECODER/DEMULTIPLEXER
IC5 = 74xx-eu:74*00: Quad 2-input NAND gate
LED1-LED21 = led:LED: LED OSRAM: - CHIPLED LG R971, LG N971, LY N971, LG Q971, LY Q971, LO R971, LY R971 LH N974, LH R974 LS Q976, LO Q976, LY Q976 LO Q996 - Hyper CHIPLED LW Q18S LB Q993, LB Q99A, LB R99A - SideLED LS A670, LO A670, LY A670, LG A670, LP A670 LB A673, LV A673, LT A673, LW A673 LH A674 LY A675 LS A676, LA A676, LO A676, LY A676, LW A676 LS A679, LY A679, LG A679 - Hyper Micro SIDELED® LS Y876, LA Y876, LO Y876, LY Y876 LT Y87S - SmartLED LW L88C, LW L88S LB L89C, LB L89S, LG L890 LS L89K, LO L89K, LY L89K LS L896, LA L896, LO L896, LY L896 - TOPLED LS T670, LO T670, LY T670, LG T670, LP T670 LSG T670, LSP T670, LSY T670, LOP T670, LYG T670 LG T671, LOG T671, LSG T671 LB T673, LV T673, LT T673, LW T673 LH T674 LS T676, LA T676, LO T676, LY T676, LB T676, LH T676, LSB T676, LW T676 LB T67C, LV T67C, LT T67C, LS T67K, LO T67K, LY T67K, LW E67C LS E67B, LA E67B, LO E67B, LY E67B, LB E67C, LV E67C, LT E67C LW T67C LS T679, LY T679, LG T679 LS T770, LO T770, LY T770, LG T770, LP T770 LB T773, LV T773, LT T773, LW T773 LH T774 LS E675, LA E675, LY E675, LS T675 LS T776, LA T776, LO T776, LY T776, LB T776 LHGB T686 LT T68C, LB T68C - Hyper Mini TOPLED® LB M676 - Mini TOPLED Santana® LG M470 LS M47K, LO M47K, LY M47K Source: http://www.osram.convergy.de LUXEON: - LUMILED® LXK2-PW12-R00, LXK2-PW12-S00, LXK2-PW14-U00, LXK2-PW14-V00 LXK2-PM12-R00, LXK2-PM12-S00, LXK2-PM14-U00 LXK2-PE12-Q00, LXK2-PE12-R00, LXK2-PE12-S00, LXK2-PE14-T00, LXK2-PE14-U00 LXK2-PB12-K00, LXK2-PB12-L00, LXK2-PB12-M00, LXK2-PB14-N00, LXK2-PB14-P00, LXK2-PB14-Q00 LXK2-PR12-L00, LXK2-PR12-M00, LXK2-PR14-Q00, LXK2-PR14-R00 LXK2-PD12-Q00, LXK2-PD12-R00, LXK2-PD12-S00 LXK2-PH12-R00, LXK2-PH12-S00 LXK2-PL12-P00, LXK2-PL12-Q00, LXK2-PL12-R00 Source: www.luxeon.com KINGBRIGHT: KA-3528ASYC Source: www.kingbright.com
R1-R21 = rcl:R-EU_: RESISTOR, European symbol; SPICEPREFIX: R
S1 = switch:55?: PUSHBUTTON SERIES 5500 SWITCHES Source: www.e-switch.com .. 5500.pdf
V1 = 74ttl-din:74*161: Synchrounus 4-bit COUNTER

## Net classes
0 default: width 0.254 mm